# EAGLE design Elec 2013 Combined (EAGLE 6.4)
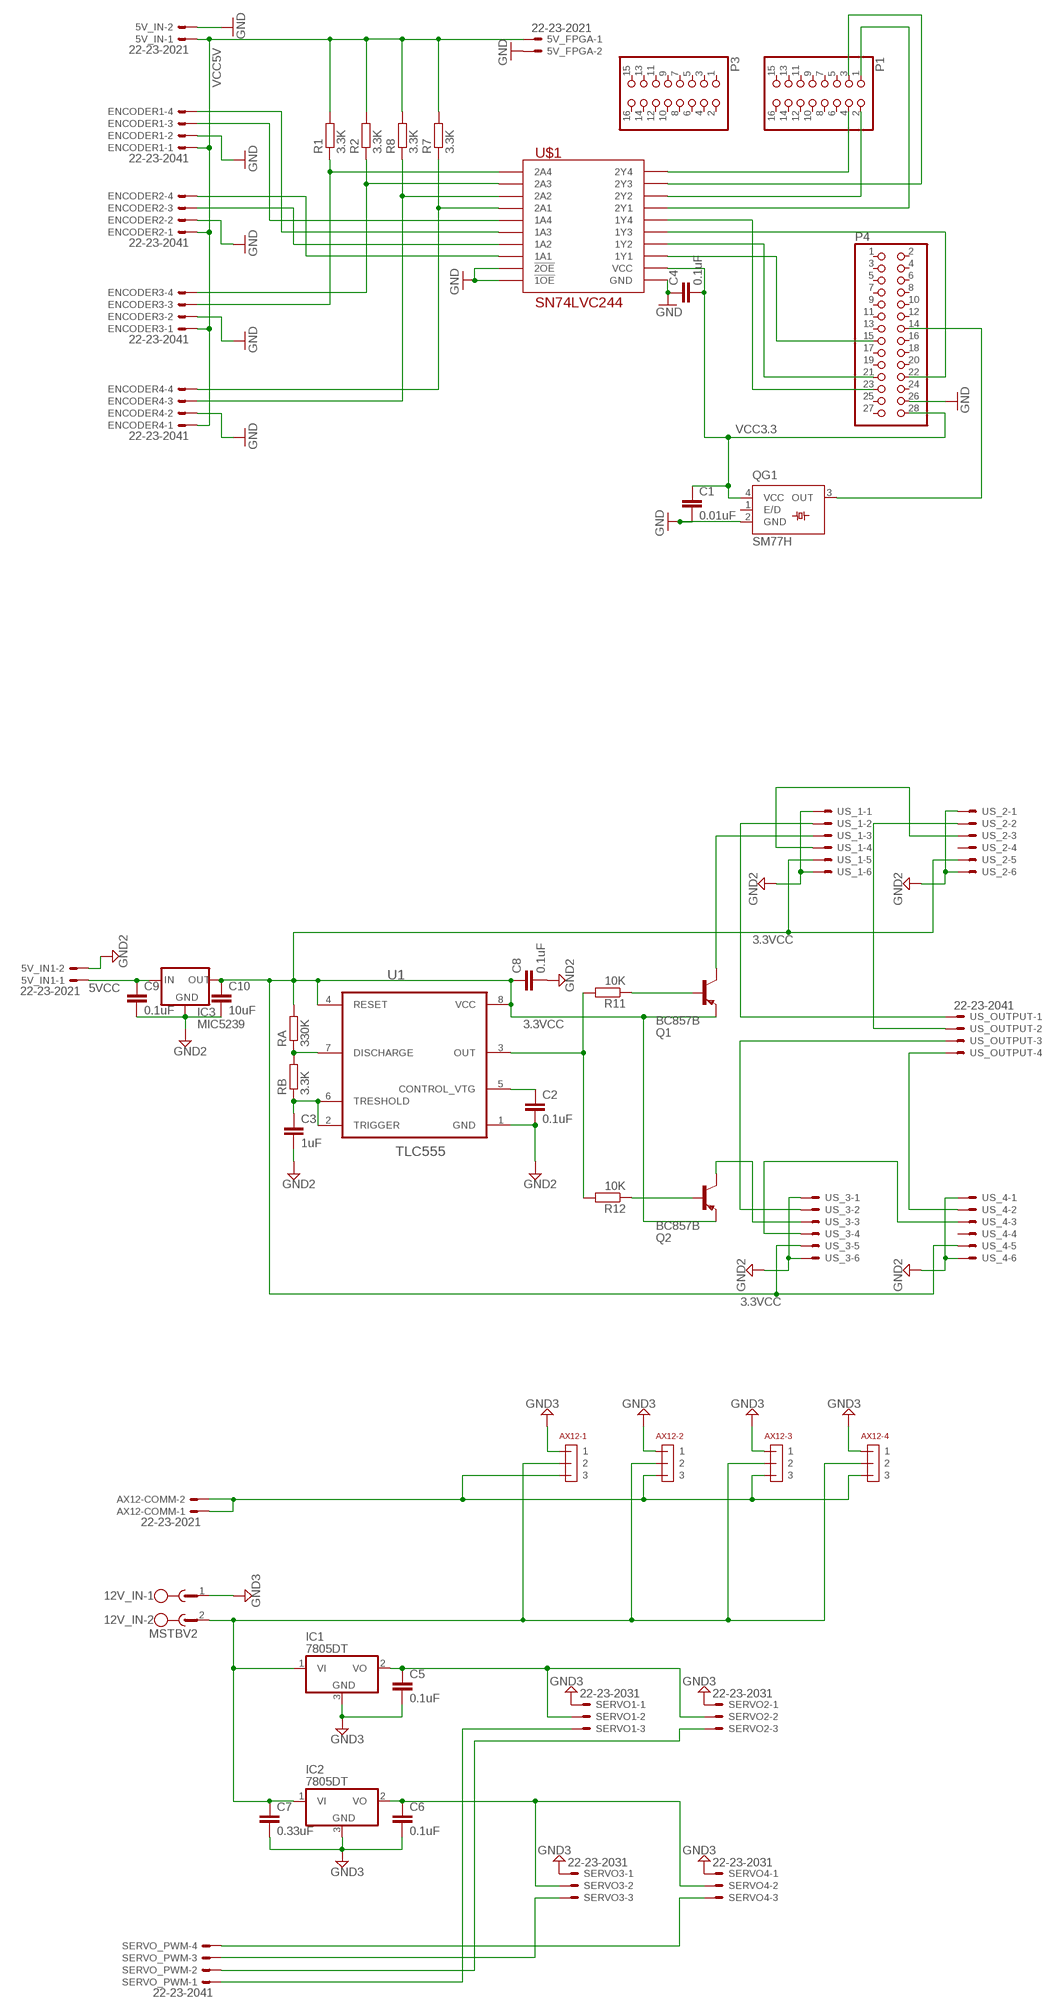
[diagram p0: schematic, sheet 1, part 1 of 2]
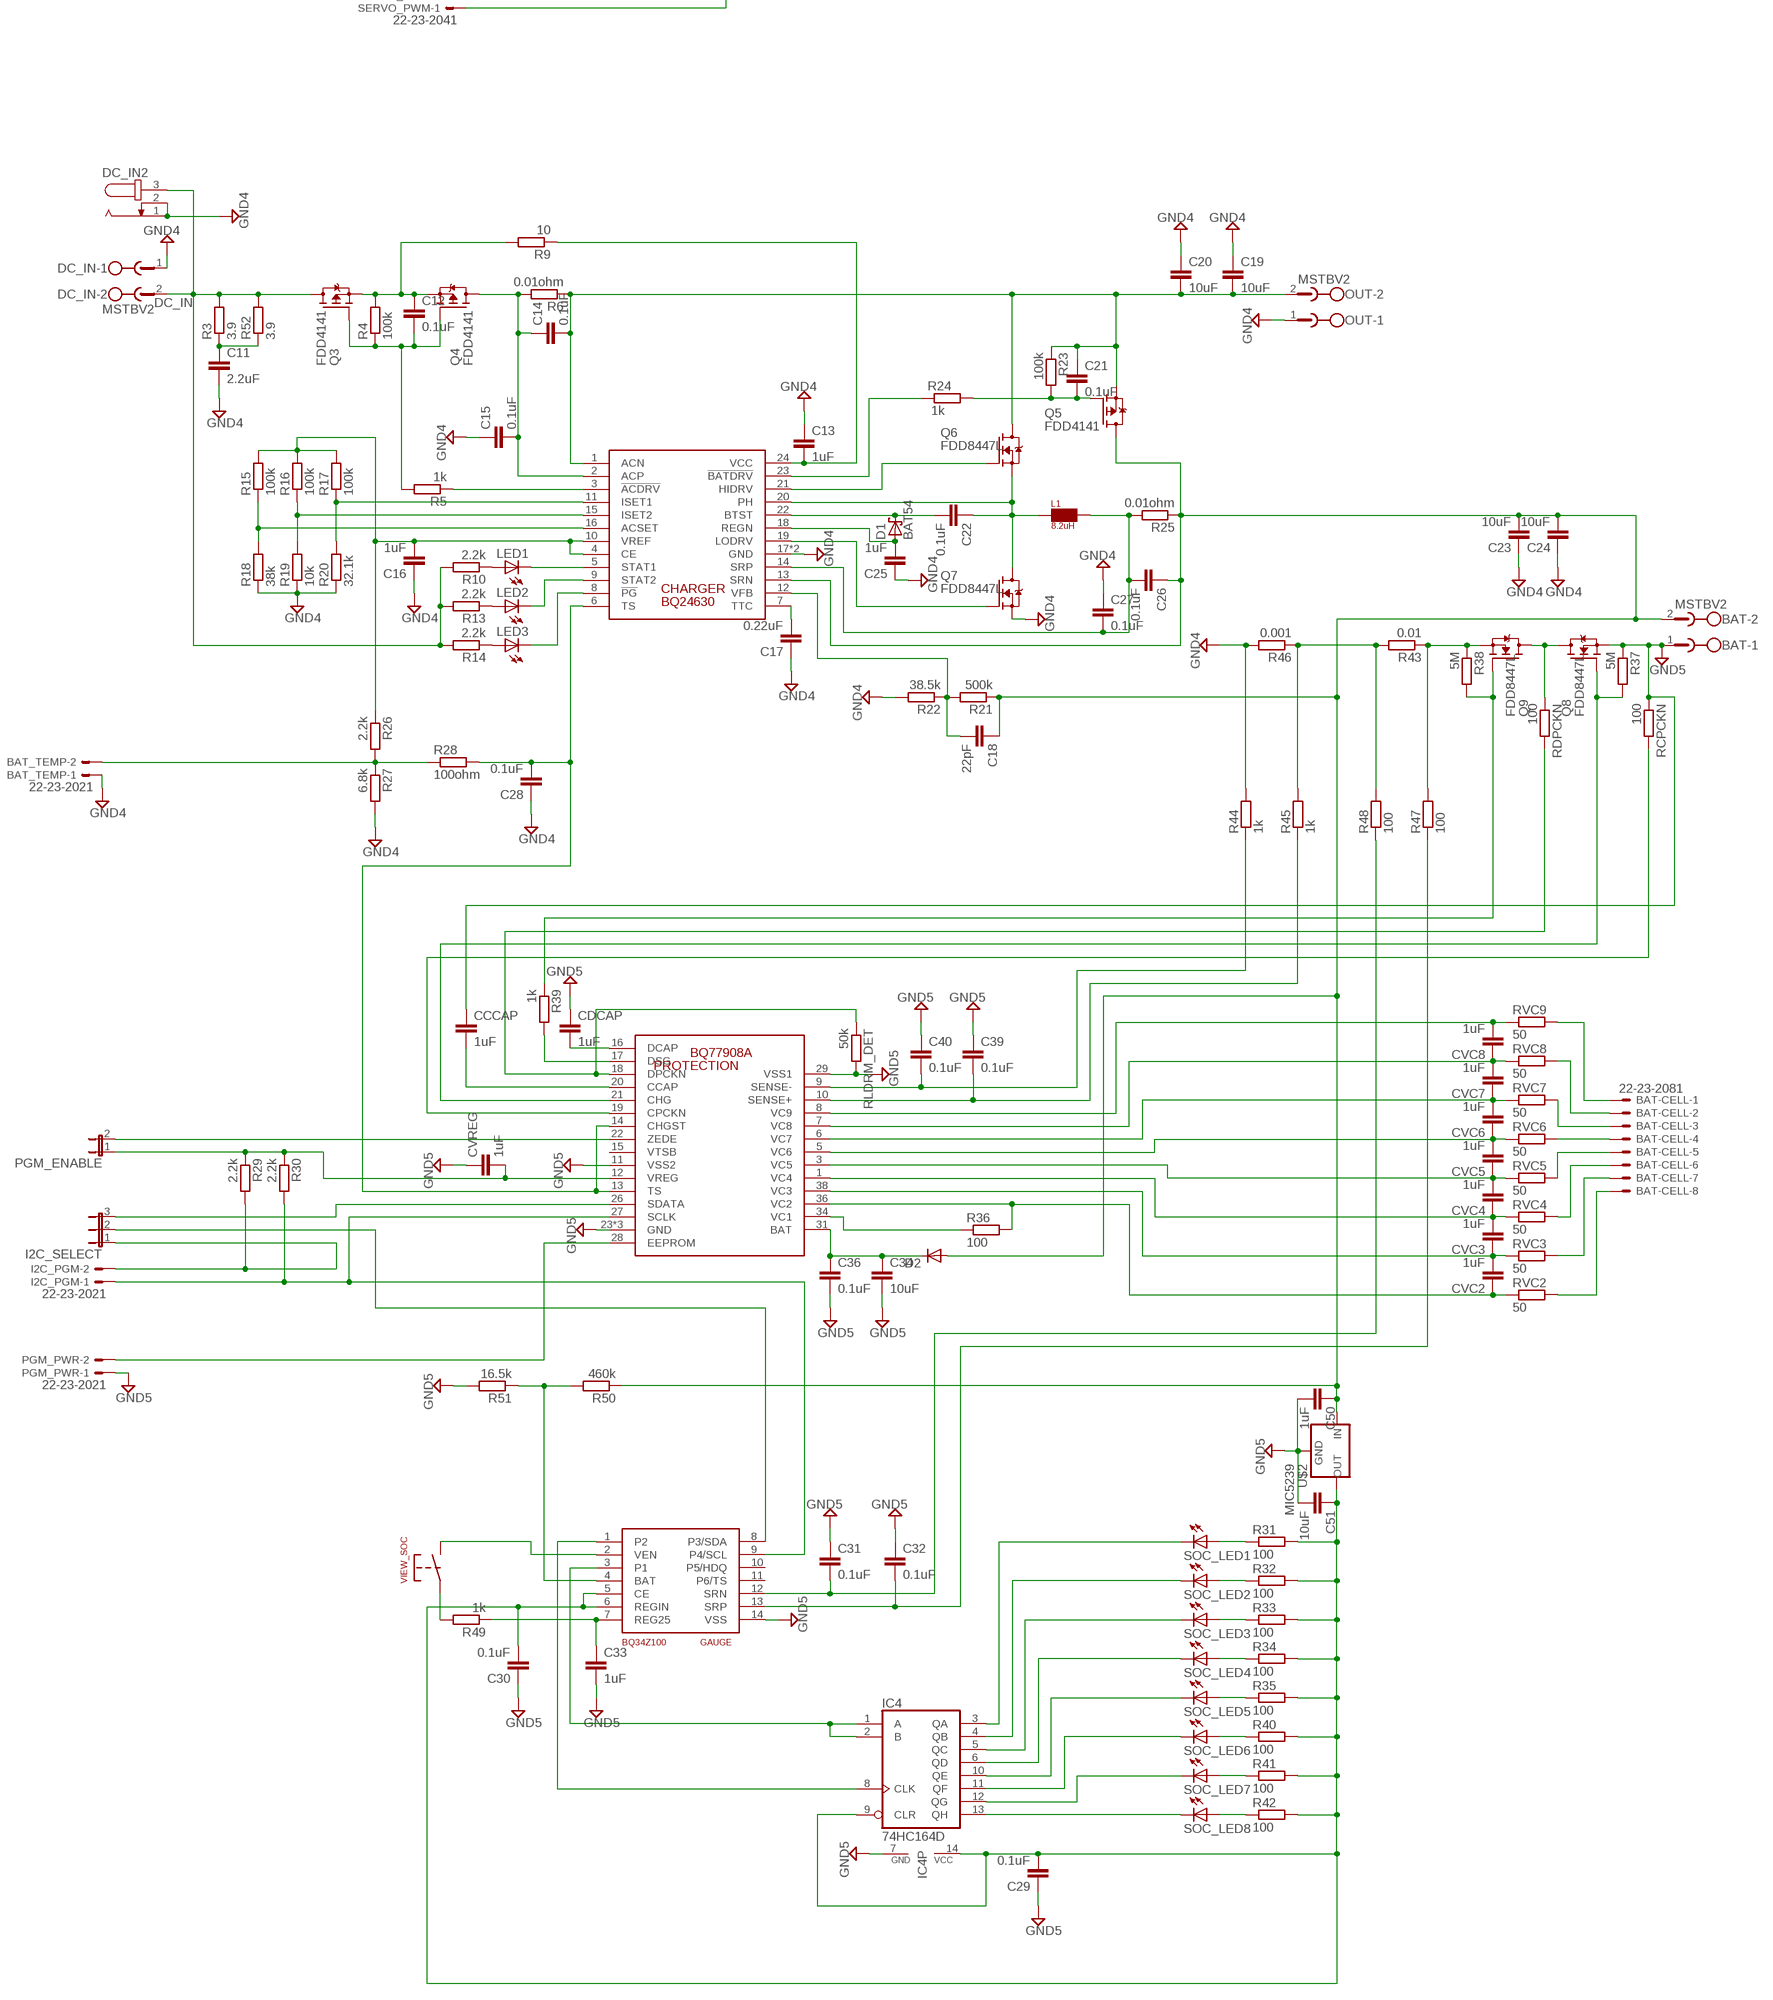
[diagram p1: schematic, sheet 1, part 2 of 2]

## Parts
5V_FPGA  22-23-2021  [22-23-2021]
5V_IN  22-23-2021  [22-23-2021]
5V_IN1  22-23-2021  [22-23-2021]
12V_IN  MSTBV2  [MSTBV2]
AX12-1  22-03-5035  [22-03-5035]
AX12-2  22-03-5035  [22-03-5035]
AX12-3  22-03-5035  [22-03-5035]
AX12-4  22-03-5035  [22-03-5035]
AX12-COMM  22-23-2021  [22-23-2021]
BAT  MSTBV2  [MSTBV2]
BAT-CELL  22-23-2081  [22-23-2081]
BAT_TEMP  22-23-2021  [22-23-2021]
C1  0.01uF  C-EUC0603  [C0603]
C2  0.1uF  C-EUC0603  [C0603]
C3  1uF  C-EUC0603  [C0603]
C4  0.1uF  C-EUC0603  [C0603]
C5  0.1uF  C-EUC0603  [C0603]
C6  0.1uF  C-EUC0603  [C0603]
C7  0.33uF  C-EUC0603  [C0603]
C8  0.1uF  C-EUC0603  [C0603]
C9  0.1uF  C-EUC0603  [C0603]
C10  10uF  C-EUC0603  [C0603]
C11  2.2uF  C-EUC1206  [C1206]
C12  0.1uF  C-EUC0603  [C0603]
C13  1uF  C-EUC1206  [C1206]
C14  0.1uF  C-EUC0603  [C0603]
C15  0.1uF  C-EUC0603  [C0603]
C16  1uF  C-EUC0805  [C0805]
C17  0.22uF  C-EUC0603  [C0603]
C18  22pF  C-EUC0603  [C0603]
C19  10uF  C-EUC1812  [C1812]
C20  10uF  C-EUC1812  [C1812]
C21  0.1uF  C-EUC0603  [C0603]
C22  0.1uF  C-EUC0603  [C0603]
C23  10uF  C-EUC1812  [C1812]
C24  10uF  C-EUC1812  [C1812]
C25  1uF  C-EUC0805  [C0805]
C26  0.1uF  C-EUC0603  [C0603]
C27  0.1uF  C-EUC0603  [C0603]
C28  0.1uF  C-EUC0603  [C0603]
C29  0.1uF  C-EUC0603  [C0603]
C30  0.1uF  C-EUC0603  [C0603]
C31  0.1uF  C-EUC0603  [C0603]
C32  0.1uF  C-EUC0603  [C0603]
C33  1uF  C-EUC0603  [C0603]
C34  10uF  C-EUC1210  [C1210]
C36  0.1uF  C-EUC1210  [C1210]
C39  0.1uF  C-EUC0603  [C0603]
C40  0.1uF  C-EUC0603  [C0603]
C50  1uF  C-EUC0603  [C0603]
C51  10uF  C-EUC0603  [C0603]
CCCAP  1uF  C-EUC1206  [C1206]
CDCAP  1uF  C-EUC1206  [C1206]
CHARGER  BQ24630  [QFN-24]
CVC2  1uF  C-EUC0603  [C0603]
CVC3  1uF  C-EUC0603  [C0603]
CVC4  1uF  C-EUC0603  [C0603]
CVC5  1uF  C-EUC0603  [C0603]
CVC6  1uF  C-EUC0603  [C0603]
CVC7  1uF  C-EUC0603  [C0603]
CVC8  1uF  C-EUC0603  [C0603]
CVREG  1uF  C-EUC0603  [C0603]
D1  BAT54  [SOT23]
D2  DIODE-SOD123  [SOD123]
DC_IN  MSTBV2  [MSTBV2]
DC_IN2  JACK-PLUG1  [SPC4078]
ENCODER1  22-23-2041  [22-23-2041]
ENCODER2  22-23-2041  [22-23-2041]
ENCODER3  22-23-2041  [22-23-2041]
ENCODER4  22-23-2041  [22-23-2041]
GAUGE  BQ34Z100  [TSSOP-14-0.65MM]
I2C_PGM  22-23-2021  [22-23-2021]
I2C_SELECT  JP2E  [JP2]
IC1  7805DT  [TO252]
IC2  7805DT  [TO252]
IC3  MIC5239  [SOT223]
IC4  74HC164D  [SO14]
L1  8.2uH  IHLP-5050CE  [5050CE]
LED1  LEDCHIP-LED0603  [CHIP-LED0603]
LED2  LEDCHIP-LED0603  [CHIP-LED0603]
LED3  LEDCHIP-LED0603  [CHIP-LED0603]
OUT  MSTBV2  [MSTBV2]
P1  PINHD-2X8  [2X08]
P3  PINHD-2X8  [2X08]
P4  PINHD-2X14  [2X14]
PGM_ENABLE  JP1E  [JP1]
PGM_PWR  22-23-2021  [22-23-2021]
PROTECTION  BQ77908A  [TSSOP-38-0.5MM]
Q1  BC857B  MMBTA56-SOT23  [SOT23]
Q2  BC857B  MMBTA56-SOT23  [SOT23]
Q3  FDD4141  FDD4141TO252  [TO252]
Q4  FDD4141  FDD4141TO252  [TO252]
Q5  FDD4141  FDD4141TO252  [TO252]
Q6  FDD8447L  [TO252]
Q7  FDD8447L  [TO252]
Q8  FDD8447L  [TO252]
Q9  FDD8447L  [TO252]
QG1  SM77H  [SM77H]
R1  3.3K  R-EU_R0603  [R0603]
R2  3.3K  R-EU_R0603  [R0603]
R3  3.9  R-EU_R1206  [R1206]
R4  100k  R-EU_R0603  [R0603]
R5  1k  R-EU_R0603  [R0603]
R6  0.01ohm  R-EU_R2010  [R2010]
R7  3.3K  R-EU_R0603  [R0603]
R8  3.3K  R-EU_R0603  [R0603]
R9  10  R-EU_R1206  [R1206]
R10  2.2k  R-EU_R0603  [R0603]
R11  10K  R-EU_R0603  [R0603]
R12  10K  R-EU_R0603  [R0603]
R13  2.2k  R-EU_R0603  [R0603]
R14  2.2k  R-EU_R0603  [R0603]
R15  100k  R-EU_R0805  [R0805]
R16  100k  R-EU_R0805  [R0805]
R17  100k  R-EU_R0805  [R0805]
R18  38k  R-EU_R0805  [R0805]
R19  10k  R-EU_R0805  [R0805]
R20  32.1k  R-EU_R0805  [R0805]
R21  500k  R-EU_R0805  [R0805]
R22  38.5k  R-EU_R0805  [R0805]
R23  100k  R-EU_R0603  [R0603]
R24  1k  R-EU_R0603  [R0603]
R25  0.01ohm  R-EU_R2010  [R2010]
R26  2.2k  R-EU_R0603  [R0603]
R27  6.8k  R-EU_R0603  [R0603]
R28  100ohm  R-EU_R0603  [R0603]
R29  2.2k  R-EU_R0603  [R0603]
R30  2.2k  R-EU_R0603  [R0603]
R31  100  R-EU_R0603  [R0603]
R32  100  R-EU_R0603  [R0603]
R33  100  R-EU_R0603  [R0603]
R34  100  R-EU_R0603  [R0603]
R35  100  R-EU_R0603  [R0603]
R36  100  R-EU_R0603  [R0603]
R37  5M  R-EU_R0603  [R0603]
R38  5M  R-EU_R0603  [R0603]
R39  1k  R-EU_R0603  [R0603]
R40  100  R-EU_R0603  [R0603]
R41  100  R-EU_R0603  [R0603]
R42  100  R-EU_R0603  [R0603]
R43  0.01  R-EU_R2010  [R2010]
R44  1k  R-EU_R0603  [R0603]
R45  1k  R-EU_R0603  [R0603]
R46  0.001  R-EU_R2010  [R2010]
R47  100  R-EU_R0603  [R0603]
R48  100  R-EU_R0603  [R0603]
R49  1k  R-EU_R0603  [R0603]
R50  460k  R-EU_R0805  [R0805]
R51  16.5k  R-EU_R0603  [R0603]
R52  3.9  R-EU_R1206  [R1206]
RA  330K  R-EU_R0603  [R0603]
RB  3.3K  R-EU_R0603  [R0603]
RCPCKN  100  R-EU_R0603  [R0603]
RDPCKN  100  R-EU_R0603  [R0603]
RLDRM_DET  50k  R-EU_R0603  [R0603]
RVC2  50  R-EU_R1206  [R1206]
RVC3  50  R-EU_R1206  [R1206]
RVC4  50  R-EU_R1206  [R1206]
RVC5  50  R-EU_R1206  [R1206]
RVC6  50  R-EU_R1206  [R1206]
RVC7  50  R-EU_R1206  [R1206]
RVC8  50  R-EU_R1206  [R1206]
RVC9  50  R-EU_R1206  [R1206]
SERVO1  22-23-2031  [22-23-2031]
SERVO2  22-23-2031  [22-23-2031]
SERVO3  22-23-2031  [22-23-2031]
SERVO4  22-23-2031  [22-23-2031]
SERVO_PWM  22-23-2041  [22-23-2041]
SOC_LED1  LEDCHIP-LED0603  [CHIP-LED0603]
SOC_LED2  LEDCHIP-LED0603  [CHIP-LED0603]
SOC_LED3  LEDCHIP-LED0603  [CHIP-LED0603]
SOC_LED4  LEDCHIP-LED0603  [CHIP-LED0603]
SOC_LED5  LEDCHIP-LED0603  [CHIP-LED0603]
SOC_LED6  LEDCHIP-LED0603  [CHIP-LED0603]
SOC_LED7  LEDCHIP-LED0603  [CHIP-LED0603]
SOC_LED8  LEDCHIP-LED0603  [CHIP-LED0603]
U1  TLC555  LM555CM  [SOIC127P600X175-8N]
U$1  SN74LVC244  [TSSOP-20-0.65MM]
U$2  MIC5239  [SOT223]
US_1  22-23-2061  [22-23-2061]
US_2  22-23-2061  [22-23-2061]
US_3  22-23-2061  [22-23-2061]
US_4  22-23-2061  [22-23-2061]
US_OUTPUT  22-23-2041  [22-23-2041]
VIEW_SOC  PUSHBUTTON  [PUSHBUTTON]

## Nets
3.3VCC: C8.1 C10.1 IC3.3(OUT) Q1.2(E) Q2.2(E) RA.2 U1.4(RESET) U1.8(VCC) US_1.5 US_2.5 US_3.5 US_4.5
5VCC: 5V_IN1.1 C9.1 IC3.1(IN)
DC_IN: DC_IN2.3 DC_IN.2 Q3.3(D) R3.2 R10.2 R13.2 R14.2 R52.2
GND: 5V_FPGA.2 5V_IN.2 C1.2 C4.1 ENCODER1.2 ENCODER2.2 ENCODER3.2 ENCODER4.2 P4.26 QG1.2(GND) U$1.P$1(!1OE) U$1.P$10(GND) U$1.P$19(!2OE)
GND2: 5V_IN1.2 C2.2 C3.2 C8.2 C9.2 C10.2 IC3.2(GND) IC3.4(GND) U1.1(GND) US_1.1 US_1.6 US_2.1 US_2.6 US_3.1 US_3.6 US_4.1 US_4.6
GND3: 12V_IN.1 AX12-1.P$1 AX12-2.P$1 AX12-3.P$1 AX12-4.P$1 C5.2 C6.2 C7.2 IC1.3(GND) IC2.3(GND) SERVO1.1 SERVO2.1 SERVO3.1 SERVO4.1
GND4: BAT_TEMP.1 C11.2 C13.1 C15.1 C16.1 C17.1 C19.1 C20.1 C23.1 C24.1 C25.1 C27.1 C28.1 CHARGER.17(GND) CHARGER.THERMAL(GND) DC_IN2.1 DC_IN2.2 DC_IN.1 OUT.1 Q7.2(S) R18.1 R19.1 R20.1 R22.2 R27.2 R44.2 R46.2
GND5: BAT.1 C29.1 C30.1 C31.1 C32.1 C33.2 C34.2 C36.2 C39.1 C40.1 C50.2 C51.2 CCCAP.1 CDCAP.1 CVREG.1 GAUGE.14(VSS) IC4.7(GND) PGM_PWR.1 PROTECTION.11(VSS2) PROTECTION.23(GND) PROTECTION.24(GND) PROTECTION.25(GND) PROTECTION.29(VSS1) Q8.2(S) R37.1 R51.2 RCPCKN.1 RLDRM_DET.2 U$2.2(GND) U$2.4(GND)
N$1: P4.14 QG1.3(OUT)
N$2: P4.23 U$1.P$12(1Y4)
N$3: P4.21 U$1.P$16(1Y2)
N$4: P4.15 U$1.P$18(1Y1)
N$5: P4.22 U$1.P$14(1Y3)
N$6: P1.4 U$1.P$3(2Y4)
N$7: P1.2 U$1.P$7(2Y2)
N$8: P1.1 U$1.P$9(2Y1)
N$9: P1.3 U$1.P$5(2Y3)
N$10: ENCODER3.3 R1.1 U$1.P$17(2A4)
N$11: ENCODER3.4 R2.1 U$1.P$15(2A3)
N$12: R11.2 R12.2 U1.3(OUT)
N$13: C11.1 R3.1 R52.1
N$14: ENCODER4.3 R8.1 U$1.P$13(2A2)
N$15: ENCODER4.4 R7.1 U$1.P$11(2A1)
N$16: ENCODER1.3 U$1.P$8(1A4)
N$17: ENCODER1.4 U$1.P$6(1A3)
N$18: ENCODER2.3 U$1.P$4(1A2)
N$19: ENCODER2.4 U$1.P$2(1A1)
N$20: C3.1 RB.1 U1.2(TRIGGER) U1.6(TRESHOLD)
N$21: C2.1 U1.5(CONTROL_VTG)
N$22: RA.1 RB.2 U1.7(DISCHARGE)
N$23: Q2.1(B) R12.1
N$24: Q1.1(B) R11.1
N$25: US_1.2 US_OUTPUT.1
N$26: US_2.2 US_OUTPUT.2
N$27: US_3.2 US_OUTPUT.3
N$28: US_4.2 US_OUTPUT.4
N$29: US_1.4 US_2.3
N$30: US_3.4 US_4.3
N$31: Q1.3(C) US_1.3
N$32: Q2.3(C) US_3.3
N$33: SERVO1.3 SERVO_PWM.1
N$34: SERVO2.3 SERVO_PWM.2
N$35: SERVO3.3 SERVO_PWM.3
N$36: C6.1 IC2.2(VO) SERVO3.2 SERVO4.2
N$37: SERVO4.3 SERVO_PWM.4
N$38: 12V_IN.2 AX12-1.P$2 AX12-2.P$2 AX12-3.P$2 AX12-4.P$2 C7.1 IC1.1(VI) IC2.1(VI)
N$39: C5.1 IC1.2(VO) SERVO1.2 SERVO2.2
N$40: AX12-1.P$3 AX12-2.P$3 AX12-3.P$3 AX12-4.P$3 AX12-COMM.1 AX12-COMM.2
N$41: C12.1 Q3.2(S) Q4.2(S) R4.2 R9.2
N$42: C12.2 Q3.1(G) Q4.1(G) R4.1 R5.2
N$43: CHARGER.3(!ACDRV!) R5.1
N$44: C17.2 CHARGER.7(TTC)
N$45: C13.2 CHARGER.24(VCC) R9.1
N$46: C14.2 C19.2 C20.2 C21.1 CHARGER.1(ACN) OUT.2 Q5.2(S) Q6.3(D) R6.1 R23.1
N$47: C18.2 CHARGER.12(VFB) R21.2 R22.1
N$48: CHARGER.5(STAT1) LED1.C
N$49: CHARGER.9(STAT2) LED2.C
N$50: CHARGER.8(!PG!) LED3.C
N$51: LED1.A R10.1
N$52: LED2.A R13.1
N$53: LED3.A R14.1
N$54: BAT_TEMP.2 R26.2 R27.1 R28.1
N$55: CHARGER.16(ACSET) R15.1 R18.2
N$56: CHARGER.15(ISET2) R16.1 R19.2
N$57: CHARGER.11(ISET1) R17.1 R20.2
N$58: Q8.3(D) Q9.3(D) RDPCKN.1
N$59: C28.2 CHARGER.6(TS) PROTECTION.13(TS) PROTECTION.14(CHGST) R28.2
N$60: C21.2 Q5.1(G) R23.2 R24.2
N$61: C32.2 GAUGE.13(SRP) R47.1
N$62: CHARGER.23(!BATDRV!) R24.1
N$63: CHARGER.21(HIDRV) Q6.1(G)
N$64: C22.1 CHARGER.20(PH) L1.P$1 Q6.2(S) Q7.3(D)
N$65: C22.2 CHARGER.22(BTST) D1.3(C)
N$66: C34.1 C36.1 D2.C PROTECTION.31(BAT)
N$67: C26.2 C27.2 CHARGER.14(SRP) L1.P$2 R25.2
N$68: BAT-CELL.8 RVC2.2
N$69: C25.2 CHARGER.18(REGN) D1.1(A)
N$70: CHARGER.19(LODRV) Q7.1(G)
N$71: CVC8.2 PROTECTION.8(VC9) RVC9.1
N$72: CVC2.1 PROTECTION.36(VC2) R36.2 RVC2.1
N$73: CVC4.2 CVC5.1 PROTECTION.3(VC5) RVC5.1
N$74: CVC2.2 CVC3.1 PROTECTION.38(VC3) RVC3.1
N$75: PROTECTION.34(VC1) R36.1
N$76: CVC6.2 CVC7.1 PROTECTION.6(VC7) RVC7.1
N$77: CVC5.2 CVC6.1 PROTECTION.5(VC6) RVC6.1
N$78: CVC3.2 CVC4.1 PROTECTION.1(VC4) RVC4.1
N$79: BAT-CELL.7 RVC3.2
N$80: BAT-CELL.6 RVC4.2
N$81: BAT-CELL.5 RVC5.2
N$82: BAT-CELL.4 RVC6.2
N$83: BAT-CELL.3 RVC7.2
N$84: BAT-CELL.2 RVC8.2
N$85: BAT-CELL.1 RVC9.2
N$86: C33.1 GAUGE.7(REG25) R49.1
N$87: Q9.1(G) R38.2 R39.1
N$88: PROTECTION.21(CHG) Q8.1(G) R37.2
N$89: PROTECTION.17(DSG) R39.2
N$90: CDCAP.2 PROTECTION.16(DCAP)
N$91: CVC7.2 CVC8.1 PROTECTION.7(VC8) RVC8.1
N$92: PROTECTION.18(DPCKN) RDPCKN.2 RLDRM_DET.1
N$93: R31.1 SOC_LED1.A
N$94: PROTECTION.19(CPCKN) RCPCKN.2
N$95: CCCAP.2 PROTECTION.20(CCAP)
N$96: R32.1 SOC_LED2.A
N$97: C39.2 PROTECTION.10(SENSE+) R45.1
N$99: C40.2 PROTECTION.9(SENSE-) R44.1
N$100: GAUGE.9(P4/SCL) I2C_PGM.1 PROTECTION.27(SCLK) R30.2
N$101: I2C_PGM.2 I2C_SELECT.1 R29.2
N$102: R33.1 SOC_LED3.A
N$103: PGM_ENABLE.2 PROTECTION.22(ZEDE)
N$104: PGM_PWR.2 PROTECTION.28(EEPROM)
N$105: C29.2 C30.2 C51.1 GAUGE.5(CE) GAUGE.6(REGIN) IC4.9(CLR) IC4.14(VCC) R31.2 R32.2 R33.2 R34.2 R35.2 R40.2 R41.2 R42.2 U$2.3(OUT)
N$106: R34.1 SOC_LED4.A
N$107: R35.1 SOC_LED5.A
N$108: R40.1 SOC_LED6.A
N$109: R41.1 SOC_LED7.A
N$110: R42.1 SOC_LED8.A
N$111: IC4.13(QH) SOC_LED8.C
N$112: IC4.3(QA) SOC_LED1.C
N$113: IC4.4(QB) SOC_LED2.C
N$114: IC4.5(QC) SOC_LED3.C
N$115: IC4.6(QD) SOC_LED4.C
N$116: IC4.10(QE) SOC_LED5.C
N$118: IC4.12(QG) SOC_LED7.C
N$120: I2C_SELECT.3 PROTECTION.26(SDATA)
N$121: GAUGE.8(P3/SDA) I2C_SELECT.2
N$122: C31.2 GAUGE.12(SRN) R48.1
N$123: GAUGE.3(P1) IC4.1(A) IC4.2(B)
N$124: GAUGE.1(P2) IC4.8(CLK)
N$126: R49.2 VIEW_SOC.P$1 VIEW_SOC.P$2
N$127: GAUGE.2(VEN) VIEW_SOC.P$3 VIEW_SOC.P$4
N$128: GAUGE.4(BAT) R50.2 R51.1
N$129: BAT.2 C18.1 C23.2 C24.2 C26.1 C50.1 CHARGER.13(SRN) D2.A Q5.3(D) R21.1 R25.1 R50.1 U$2.1(IN)
N$130: CVREG.2 PGM_ENABLE.1 PROTECTION.12(VREG) R29.1 R30.1
N$131: R43.2 R45.2 R46.1 R48.2
N$132: Q9.2(S) R38.1 R43.1 R47.2
SI7617DN: C14.1 C15.2 CHARGER.2(ACP) Q4.3(D) R6.2
SOC_LED6: IC4.11(QF) SOC_LED6.C
VCC3.3: C1.1 C4.2 P4.28 QG1.4(VCC) U$1.P$20(VCC)
VCC5V: 5V_FPGA.1 5V_IN.1 ENCODER1.1 ENCODER2.1 ENCODER3.1 ENCODER4.1 R1.2 R2.2 R7.2 R8.2
VREF: C16.2 CHARGER.4(CE) CHARGER.10(VREF) R15.2 R16.2 R17.2 R26.1
Unconnected: GAUGE.10(P5/HDQ) GAUGE.11(P6/TS) P1.5 P1.6 P1.7 P1.8 P1.9 P1.10 P1.11 P1.12 P1.13 P1.14 P1.15 P1.16 P3.1 P3.2 P3.3 P3.4 P3.5 P3.6 P3.7 P3.8 P3.9 P3.10 P3.11 P3.12 P3.13 P3.14 P3.15 P3.16 P4.1 P4.2 P4.3 P4.4 P4.5 P4.6 P4.7 P4.8 P4.9 P4.10 P4.11 P4.12 P4.13 P4.16 P4.17 P4.18 P4.19 P4.20 P4.24 P4.25 P4.27 PROTECTION.15(VTSB) QG1.1(E/D) US_2.4 US_4.4

## Library data of the parts
5V_FPGA 5V_IN 5V_IN1 AX12-COMM BAT_TEMP I2C_PGM PGM_PWR = con-molex:22-23-2021: .100" (2.54mm) Center Header - 2 Pin; MF: MOLEX; MPN: 22-23-2021; OC_FARNELL: 1462926; OC_NEWARK: 25C3832
12V_IN BAT DC_IN OUT = con-phoenix-508:MSTBV2: PHOENIX; MPN: MSTBV 2,5/2-GF-5.08; OC_FARNELL: 1792792; OC_NEWARK: 69R9845
AX12-1-AX12-4 = custom:22-03-5035
BAT-CELL = con-molex:22-23-2081: .100" (2.54mm) Center Header - 8 Pin; MF: MOLEX; MPN: 22-23-2081; OC_FARNELL: 1756826; OC_NEWARK: 01C7592
C1-C34 C36 C39 C40 C50 C51 CCCAP CDCAP CVC2-CVC8 CVREG = rcl:C-EU: CAPACITOR, European symbol
CHARGER = custom:BQ24630
D1 = diode:BAT54: Schottky Diodes Source: Fairchild .. BAT54.pdf
D2 = diode:DIODE-: DIODE
DC_IN2 = con-jack:JACK-PLUG: DC POWER JACK Power Jack, DC, Right Angle, Through Hole, Rated 5A at 16VDC, PC Terminals Distributor: Farnell (www.Farnell.de) Drawing: 84N1161.pdf / 84N1162.pdf Manufacturer: SPC Technology (www.spctechnology.com) Type: SPC4077 / SPC 4078; OC_FARNELL: unknown; OC_NEWARK: unknown
ENCODER1-ENCODER4 SERVO_PWM US_OUTPUT = con-molex:22-23-2041: .100" (2.54mm) Center Header - 4 Pin; MF: MOLEX; MPN: 22-23-2041; OC_FARNELL: 1462920; OC_NEWARK: 38C0355
GAUGE = custom:BQ34Z100
I2C_SELECT = jumper:JP2E: JUMPER
IC1 IC2 = linear:78*: Positive VOLTAGE REGULATOR Source: http://cache.national.com/ds/LM/LM78L05.pdf http://www.fairchildsemi.com/ds/LM/LM7805.pdf
IC3 U$2 = v-reg:MIC5239
IC4 = 74xx-eu:74*164: 8-bit parallel out SHIFT REGISTER
L1 = custom:IHLP-5050CE
LED1-LED3 SOC_LED1-SOC_LED8 = led:LED: LED OSRAM: - CHIPLED LG R971, LG N971, LY N971, LG Q971, LY Q971, LO R971, LY R971 LH N974, LH R974 LS Q976, LO Q976, LY Q976 LO Q996 - Hyper CHIPLED LW Q18S LB Q993, LB Q99A, LB R99A - SideLED LS A670, LO A670, LY A670, LG A670, LP A670 LB A673, LV A673, LT A673, LW A673 LH A674 LY A675 LS A676, LA A676, LO A676, LY A676, LW A676 LS A679, LY A679, LG A679 - Hyper Micro SIDELED® LS Y876, LA Y876, LO Y876, LY Y876 LT Y87S - SmartLED LW L88C, LW L88S LB L89C, LB L89S, LG L890 LS L89K, LO L89K, LY L89K LS L896, LA L896, LO L896, LY L896 - TOPLED LS T670, LO T670, LY T670, LG T670, LP T670 LSG T670, LSP T670, LSY T670, LOP T670, LYG T670 LG T671, LOG T671, LSG T671 LB T673, LV T673, LT T673, LW T673 LH T674 LS T676, LA T676, LO T676, LY T676, LB T676, LH T676, LSB T676, LW T676 LB T67C, LV T67C, LT T67C, LS T67K, LO T67K, LY T67K, LW E67C LS E67B, LA E67B, LO E67B, LY E67B, LB E67C, LV E67C, LT E67C LW T67C LS T679, LY T679, LG T679 LS T770, LO T770, LY T770, LG T770, LP T770 LB T773, LV T773, LT T773, LW T773 LH T774 LS E675, LA E675, LY E675, LS T675 LS T776, LA T776, LO T776, LY T776, LB T776 LHGB T686 LT T68C, LB T68C - Hyper Mini TOPLED® LB M676 - Mini TOPLED Santana® LG M470 LS M47K, LO M47K, LY M47K Source: http://www.osram.convergy.de LUXEON: - LUMILED® LXK2-PW12-R00, LXK2-PW12-S00, LXK2-PW14-U00, LXK2-PW14-V00 LXK2-PM12-R00, LXK2-PM12-S00, LXK2-PM14-U00 LXK2-PE12-Q00, LXK2-PE12-R00, LXK2-PE12-S00, LXK2-PE14-T00, LXK2-PE14-U00 LXK2-PB12-K00, LXK2-PB12-L00, LXK2-PB12-M00, LXK2-PB14-N00, LXK2-PB14-P00, LXK2-PB14-Q00 LXK2-PR12-L00, LXK2-PR12-M00, LXK2-PR14-Q00, LXK2-PR14-R00 LXK2-PD12-Q00, LXK2-PD12-R00, LXK2-PD12-S00 LXK2-PH12-R00, LXK2-PH12-S00 LXK2-PL12-P00, LXK2-PL12-Q00, LXK2-PL12-R00 Source: www.luxeon.com KINGBRIGHT: KA-3528ASYC Source: www.kingbright.com
P1 P3 = pinhead:PINHD-2X8: PIN HEADER
P4 = pinhead:PINHD-2X14: PIN HEADER
PGM_ENABLE = jumper:JP1E: JUMPER
PROTECTION = custom:BQ77908A
Q1 Q2 = transistor-pnp:*-?: PNP Transistor
Q3-Q5 = transistor-fet:FDD4141: P-Channel PowerTrench® MOSFET Source: FDD4141.pdf
Q6-Q9 = transistor-fet:FDD8447L
QG1 = crystal:SM77H: 3.3V CMOS Clock Oscillator Source: www.pletronics.com .. sm77h%203.3v.pdf; OC_FARNELL: unknown; OC_NEWARK: unknown
R1-R52 RA RB RCPCKN RDPCKN RLDRM_DET RVC2-RVC9 = rcl:R-EU_: RESISTOR, European symbol
SERVO1-SERVO4 = con-molex:22-23-2031: .100" (2.54mm) Center Header - 3 Pin; MF: MOLEX; MPN: 22-23-2031; OC_FARNELL: 1462950; OC_NEWARK: 30C0862
U1 = custom:LM555CM: Single Timer; MPN: LM555CM; OC_FARNELL: 9488227; OC_NEWARK: 78K6011; PACKAGE: SOIC-8; SUPPLIER: LM555CM
U$1 = custom:SN74LVC244
US_1-US_4 = con-molex:22-23-2061: .100" (2.54mm) Center Header - 6 Pin; MF: MOLEX; MPN: 22-23-2061; OC_FARNELL: 1462922; OC_NEWARK: 27C1933
VIEW_SOC = custom:PUSHBUTTON

## Board
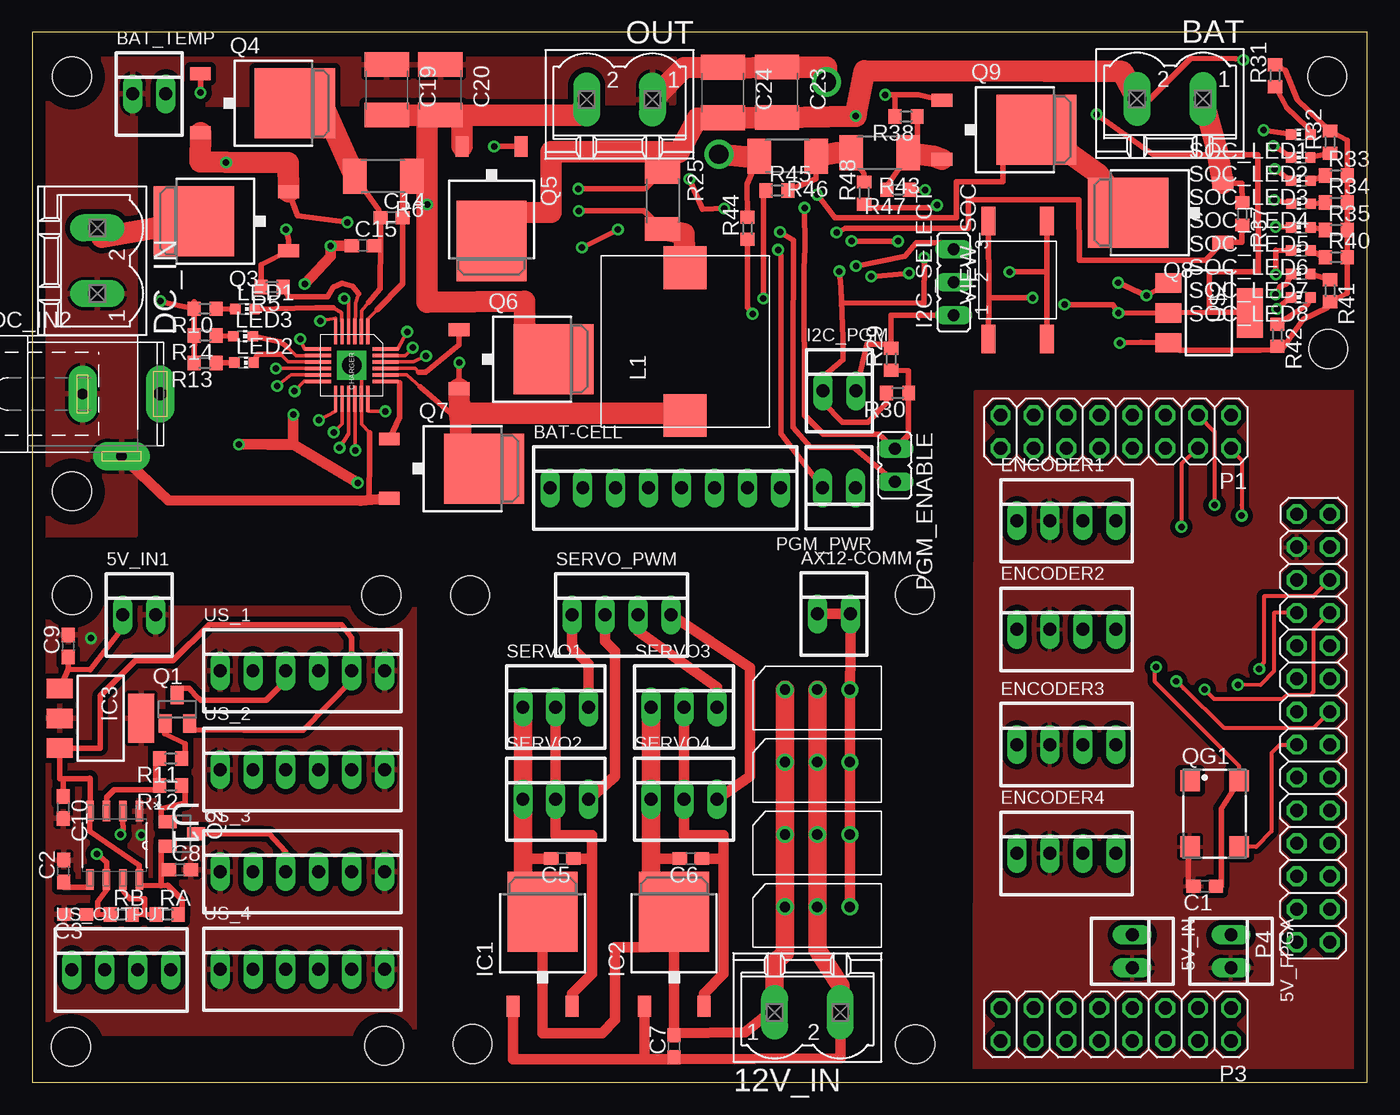
[diagram p2: board, top side]
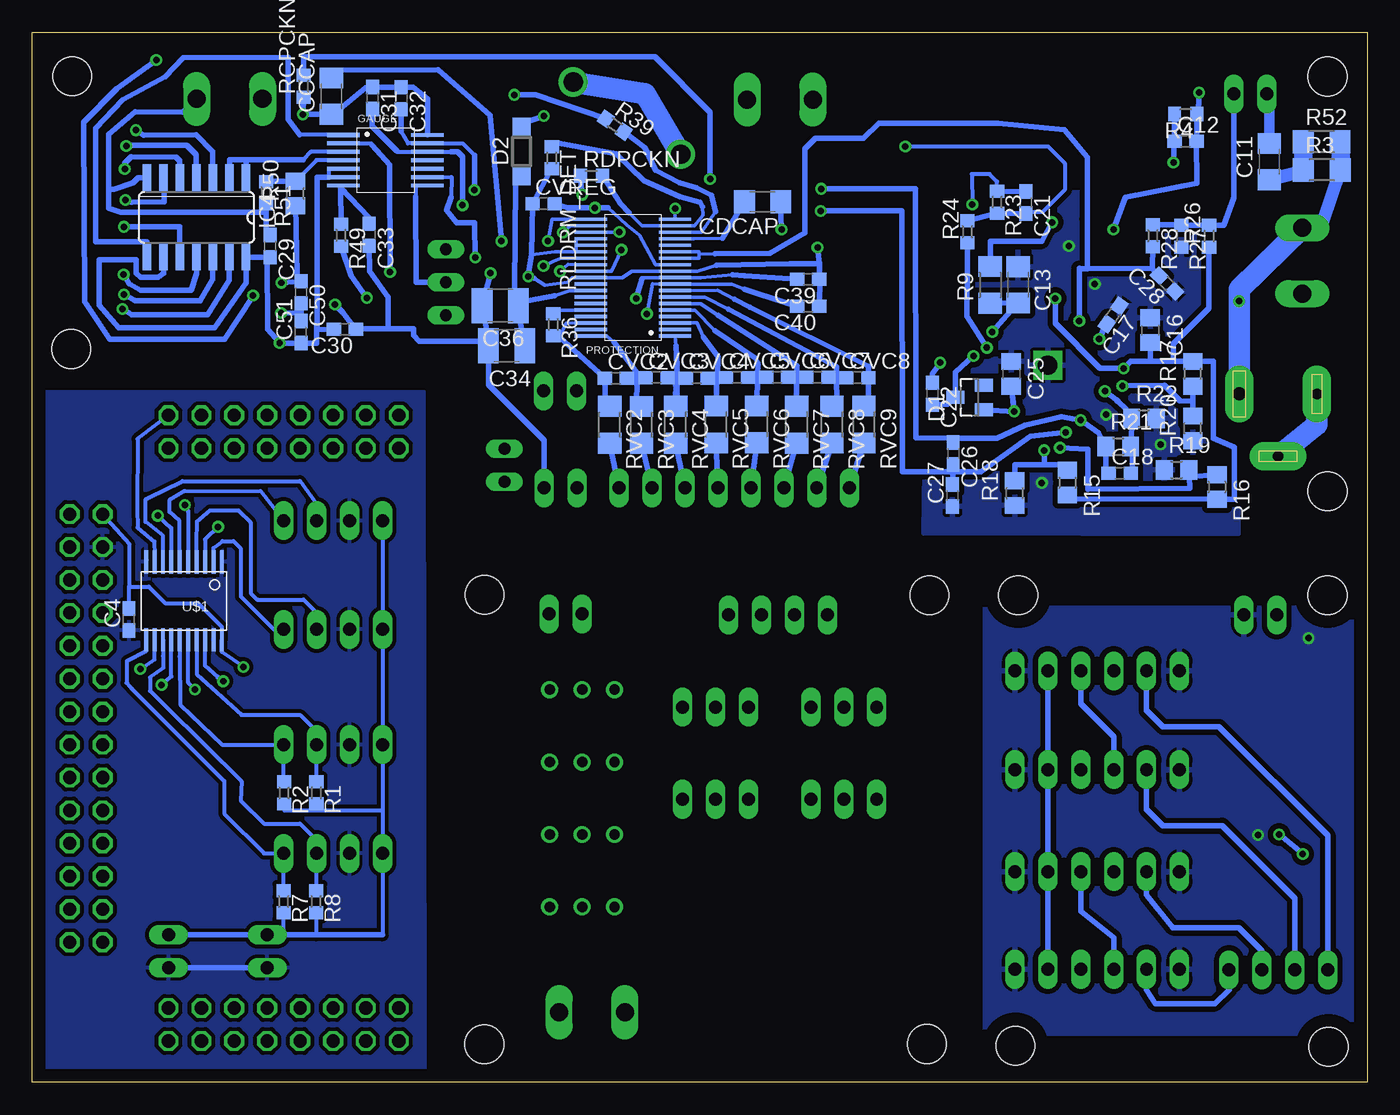
[diagram p3: board, bottom side, seen from below]

Size 103 x 81 mm. Coordinates in mm from the lower left corner, seen from the top.
Outline: 0,0 103,0 103,81 0,81 0,0
Copper layers (1*16): Top 0.035mm / dielectric 1.5mm / Bottom 0.035mm
Design rules "default *": minimum track width 8mil, minimum drill 0.3mm, track to track 8mil, track to pad 8mil, pad to pad 8mil, via to via 8mil, smd to smd 8mil, copper to edge 40mil, drill to drill 8mil, minimum pad ring 10mil, minimum via ring 8mil, stop-mask expansion 4mil, vias tented up to drill 0mil, thermal gap 10mil
Holes 3 mm at 2.98,2.74 3.05,37.59 68.12,2.93 68.1,37.63 26.92,37.59 27.14,2.84 33.78,37.59 33.98,2.96 3.05,45.59 3.05,77.59 99.92,77.62 100,56.58

### Footprints (pad centres in the part's own frame; a part is rotated, then mirrored left to right if it is on the bottom)
22-23-2021 = drill 1 long: 1 -1.27,0; 2 1.27,0
MSTBV2 = drill 1.397 long: 1 -2.54,0; 2 2.54,0
22-03-5035 = drill 0.8: P$1 -2.5,0; P$2 0,0; P$3 2.5,0
22-23-2081 = drill 1 long: 1 -8.89,0; 2 -6.35,0; 3 -3.81,0; 4 -1.27,0; 5 1.27,0; 6 3.81,0; 7 6.35,0; 8 8.89,0
C0603 = smd 1.1 x 1: 1 -0.85,0; 2 0.85,0
C1206 = smd 1.6 x 1.8: 1 -1.4,0; 2 1.4,0
C0805 = smd 1.3 x 1.5: 1 -0.95,0; 2 0.95,0
C1812 = smd 1.9 x 3.4: 1 -1.95,0; 2 1.95,0
C1210 = smd 1.6 x 2.7: 1 -1.4,0; 2 1.4,0
QFN-24 = smd 2 x 0.25: 1 -2.6,1.25; 2 -2.6,0.75; 3 -2.6,0.25; 4 -2.6,-0.25; 5 -2.6,-0.75; 6 -2.6,-1.25; 13 2.6,-1.25; 14 2.6,-0.75; 15 2.6,-0.25; 16 2.6,0.25; 17 2.6,0.75; 18 2.6,1.25 | smd 0.25 x 2: 7 -1.25,-2.6; 8 -0.75,-2.6; 9 -0.25,-2.6; 10 0.25,-2.6; 11 0.75,-2.6; 12 1.25,-2.6; 19 1.25,2.6; 20 0.75,2.6; 21 0.25,2.6; 22 -0.25,2.6; 23 -0.75,2.6; 24 -1.25,2.6 | drill 1.5 pad 1.93 square: THERMAL 0,0
SOT23 = smd 1 x 1.4: 1 -0.95,-1.1; 2 0.95,-1.1; 3 0,1.1
SOD123 = smd 1.4 x 1.4: A 1.9,0; C -1.9,0
SPC4078 = drill 0.8 pad 2.184 long: 1 -3,0; 2 0,-4.8 | drill 1 pad 2.184 long: 3 3,0
22-23-2041 = drill 1 long: 1 -3.81,0; 2 -1.27,0; 3 1.27,0; 4 3.81,0
TSSOP-14-0.65MM = smd 2.5 x 0.35: 1 -3.25,1.95 | smd 2.5 x 0.3: 2 -3.25,1.3; 3 -3.25,0.65; 4 -3.25,0; 5 -3.25,-0.65; 6 -3.25,-1.3; 7 -3.25,-1.95; 8 3.25,-1.95; 9 3.25,-1.3; 10 3.25,-0.65; 11 3.25,0; 12 3.25,0.65; 13 3.25,1.3; 14 3.25,1.95
JP2 = drill 0.914 long: 1 -2.54,0; 2 0,0; 3 2.54,0
TO252 = smd 1 x 1.6: 1 -2.28,-4.8; 2 2.28,-4.8 | smd 5.4 x 6.2: 3 0,2.5
SOT223 = smd 1.5 x 2: 1 -2.3,-3.15; 2 0,-3.15; 3 2.3,-3.15 | smd 3.8 x 2: 4 0,3.15
SO14 = smd 0.66 x 2.032: 1 -3.81,-3.073; 2 -2.54,-3.073; 3 -1.27,-3.073; 4 0,-3.073; 5 1.27,-3.073; 6 2.54,-3.073; 7 3.81,-3.073; 8 3.81,3.073; 9 2.54,3.073; 10 1.27,3.073; 11 0,3.073; 12 -1.27,3.073; 13 -2.54,3.073; 14 -3.81,3.073
5050CE = smd 3.3 x 3.3: P$1 -5.7,0; P$2 5.7,0
CHIP-LED0603 = smd 0.8 x 0.8: A 0,-0.75; C 0,0.75
2X08 = drill 1.016 octagon: 1 -8.89,-1.27; 2 -8.89,1.27; 3 -6.35,-1.27; 4 -6.35,1.27; 5 -3.81,-1.27; 6 -3.81,1.27; 7 -1.27,-1.27; 8 -1.27,1.27; 9 1.27,-1.27; 10 1.27,1.27; 11 3.81,-1.27; 12 3.81,1.27; 13 6.35,-1.27; 14 6.35,1.27; 15 8.89,-1.27; 16 8.89,1.27
2X14 = drill 1.016 octagon: 1 -16.51,-1.27; 2 -16.51,1.27; 3 -13.97,-1.27; 4 -13.97,1.27; 5 -11.43,-1.27; 6 -11.43,1.27; 7 -8.89,-1.27; 8 -8.89,1.27; 9 -6.35,-1.27; 10 -6.35,1.27; 11 -3.81,-1.27; 12 -3.81,1.27; 13 -1.27,-1.27; 14 -1.27,1.27; 15 1.27,-1.27; 16 1.27,1.27; 17 3.81,-1.27; 18 3.81,1.27; 19 6.35,-1.27; 20 6.35,1.27; 21 8.89,-1.27; 22 8.89,1.27; 23 11.43,-1.27; 24 11.43,1.27; 25 13.97,-1.27; 26 13.97,1.27; 27 16.51,-1.27; 28 16.51,1.27
JP1 = drill 0.914 long: 1 0,-1.27; 2 0,1.27
TSSOP-38-0.5MM = smd 2.5 x 0.25: 1 -3.25,4.65; 2 -3.25,4.15; 3 -3.25,3.65; 4 -3.25,3.15; 5 -3.25,2.65; 6 -3.25,2.15; 7 -3.25,1.65; 8 -3.25,1.15; 9 -3.25,0.65; 10 -3.25,0.15; 11 -3.25,-0.35; 12 -3.25,-0.85; 13 -3.25,-1.35; 14 -3.25,-1.85; 15 -3.25,-2.35; 16 -3.25,-2.85; 17 -3.25,-3.35; 18 -3.25,-3.85; 19 -3.25,-4.35; 20 3.25,-4.35; 21 3.25,-3.85; 22 3.25,-3.35; 23 3.25,-2.85; 24 3.25,-2.35; 25 3.25,-1.85; 26 3.25,-1.35; 27 3.25,-0.85; 28 3.25,-0.35; 29 3.25,0.15; 30 3.25,0.65; 31 3.25,1.15; 32 3.25,1.65; 33 3.25,2.15; 34 3.25,2.65; 35 3.25,3.15; 36 3.25,3.65; 37 3.25,4.15; 38 3.25,4.65
SM77H = smd 1.6 x 1.5: 1 -2.55,-1.9; 2 2.55,-1.9; 3 2.55,1.9; 4 -2.55,1.9
R0603 = smd 1 x 1.1: 1 -0.85,0; 2 0.85,0
R1206 = smd 1.6 x 1.803: 1 -1.422,0; 2 1.422,0
R2010 = smd 1.8 x 2.7: 1 -2.2,0; 2 2.2,0
R0805 = smd 1.3 x 1.5: 1 -0.95,0; 2 0.95,0
22-23-2031 = drill 1 long: 1 -2.54,0; 2 0,0; 3 2.54,0
SOIC127P600X175-8N = smd 1.6 x 0.559: 1 -2.642,1.905; 2 -2.642,0.635; 3 -2.642,-0.635; 4 -2.642,-1.905; 5 2.642,-1.905; 6 2.642,-0.635; 7 2.642,0.635; 8 2.642,1.905
TSSOP-20-0.65MM = smd 0.3 x 1.8: P$1 -2.925,-3; P$2 -2.275,-3; P$3 -1.625,-3; P$4 -0.975,-3; P$5 -0.325,-3; P$6 0.325,-3; P$7 0.975,-3; P$8 1.625,-3; P$9 2.275,-3; P$10 2.925,-3; P$11 2.925,3; P$12 2.275,3; P$13 1.625,3; P$14 0.975,3; P$15 0.325,3; P$16 -0.325,3; P$17 -0.975,3; P$18 -1.625,3; P$19 -2.275,3; P$20 -2.925,3
22-23-2061 = drill 1 long: 1 -6.35,0; 2 -3.81,0; 3 -1.27,0; 4 1.27,0; 5 3.81,0; 6 6.35,0
PUSHBUTTON = smd 2.184 x 1.067: P$1 -4.55,2.25; P$2 4.55,2.25; P$3 -4.55,-2.25; P$4 4.55,-2.25

### Placement (x,y rotation side)
5V_FPGA  92.5,10.12 270 top
5V_IN  84.88,10.12 270 top
5V_IN1  8.24,36.07 0 top
12V_IN  59.81,5.41 0 top
AX12-1  60.58,30.3 0 top
AX12-2  60.58,24.71 0 top
AX12-3  60.58,19.12 0 top
AX12-4  60.58,13.54 0 top
AX12-COMM  61.85,36.14 0 top
BAT  87.79,75.87 180 top
BAT-CELL  48.82,45.86 0 top
BAT_TEMP  9.02,76.26 0 top
C1  90.47,15.14 180 top
C2  2.4,16.3 90 top
C3  3.3,12.95 180 top
C4  95.55,35.71 90 bottom
C5  40.89,17.27 180 top
C6  50.8,17.27 180 top
C7  49.53,2.79 90 top
C8  11.38,16.4 0 top
C9  2.77,33.67 90 top
C10  2.38,21.21 270 top
C11  7.55,71.03 90 bottom
C12  14.01,72.6 0 bottom
C13  26.94,61.53 270 bottom
C14  27.72,66.7 0 top
C15  25.5,64.56 0 top
C16  16.73,58.03 270 bottom
C17  19.6,59.2 235 bottom
C18  19.09,46.99 0 bottom
C19  27.35,76.56 270 top
C20  31.48,76.56 270 top
C21  26.34,67.88 270 bottom
C22  33.55,53.13 270 bottom
C23  57.45,76.38 270 top
C24  53.29,76.37 270 top
C25  27.46,54.67 270 bottom
C26  31.94,48.52 270 bottom
C27  32.01,45.28 90 bottom
C28  15.45,61.63 135 bottom
C29  84.65,64.51 270 bottom
C30  78.89,58.11 180 bottom
C31  76.75,75.94 270 bottom
C32  74.53,75.92 270 bottom
C33  77,65.39 270 bottom
C34  66.41,56.83 180 bottom
C36  66.91,59.93 180 bottom
C39  43.13,61.95 180 bottom
C40  43.13,59.88 180 bottom
C50  82.27,60.96 270 bottom
C51  82.28,57.89 90 bottom
CCCAP  79.92,76.09 90 bottom
CDCAP  46.66,67.94 180 bottom
CHARGER  24.64,55.32 270 top
CVC2  57.97,54.33 0 bottom
CVC3  54.83,54.38 0 bottom
CVC4  51.73,54.34 0 bottom
CVC5  48.62,54.38 0 bottom
CVC6  45.51,54.39 0 bottom
CVC7  42.41,54.4 0 bottom
CVC8  39.33,54.37 0 bottom
CVREG  63.56,67.79 0 bottom
D1  30.68,52.85 90 bottom
D2  65.24,71.81 90 bottom
DC_IN  5.01,63.38 90 top
DC_IN2  6.87,53.11 0 top
ENCODER1  79.8,43.33 0 top
ENCODER2  79.8,34.95 0 top
ENCODER3  79.8,26.06 0 top
ENCODER4  79.8,17.67 0 top
GAUGE  75.76,71.14 0 bottom
I2C_PGM  62.27,53.35 0 top
I2C_SELECT  71.1,61.73 90 top
IC1  39.37,10.67 0 top
IC2  49.53,10.67 0 top
IC3  5.26,28.09 270 top
IC4  90.33,66.73 180 bottom
L1  50.37,57.15 90 top
LED1  16.41,59.66 270 top
LED2  16.33,55.53 270 top
LED3  16.27,57.56 270 top
OUT  45.31,75.82 180 top
P1  83.61,50.19 180 top
P3  83.61,4.47 180 top
P4  98.85,27.33 90 top
PGM_ENABLE  66.57,47.6 180 top
PGM_PWR  62.24,45.87 180 top
PROTECTION  56.66,62.23 180 bottom
Q1  11.18,28.79 0 top
Q2  11.53,19.17 270 top
Q3  14.97,66.44 90 top
Q4  17.77,75.53 270 top
Q5  35.42,67.4 180 top
Q6  37.72,55.79 270 top
Q7  32.36,47.35 270 top
Q8  87.07,67.1 90 top
Q9  74.98,73.5 270 top
QG1  91.23,20.73 270 top
R1  81.08,22.34 270 bottom
R2  83.58,22.33 270 bottom
R3  3.5,70.39 0 bottom
R4  14.01,74.7 180 bottom
R5  18.5,61.36 180 top
R6  27.08,69.9 180 top
R7  83.61,13.95 270 bottom
R8  81.1,13.95 270 bottom
R9  29.08,61.52 90 bottom
R10  13.32,59.69 180 top
R11  10.67,24.99 180 top
R12  10.67,22.91 180 top
R13  13.32,55.5 180 top
R14  13.34,57.61 180 top
R15  23.13,46.27 270 bottom
R16  11.58,45.93 270 bottom
R17  13.45,54.67 90 bottom
R18  27.19,45.46 90 bottom
R19  14.71,47.25 0 bottom
R20  13.45,50.46 90 bottom
R21  19.2,49.06 0 bottom
R22  17.22,51.23 0 bottom
R23  28.56,67.91 270 bottom
R24  30.85,65.62 90 bottom
R25  48.64,68.02 270 top
R26  12.2,65.29 90 bottom
R27  14.34,65.29 270 bottom
R28  16.53,65.31 270 bottom
R29  66.27,55.8 90 top
R30  66.77,53.18 180 top
R31  95.9,77.67 90 top
R32  100.15,72.54 90 top
R33  100.61,69.96 0 top
R34  100.61,67.87 0 top
R35  100.61,65.76 0 top
R36  62.8,58.46 270 bottom
R37  93.36,66.99 270 top
R38  67.43,74.51 180 top
R39  58.05,73.84 325 bottom
R40  100.61,63.66 0 top
R41  100.14,61.08 270 top
R42  96.07,57.63 270 top
R43  65.38,71.7 180 top
R44  55.18,65.89 90 top
R45  57.47,68.8 0 top
R46  58.29,71.46 180 top
R47  66.81,68.86 180 top
R48  64.19,68.61 90 top
R49  79.18,65.35 270 bottom
R50  82.69,68.57 90 bottom
R51  84.95,68.63 270 bottom
R52  3.5,72.56 0 bottom
RA  10.41,12.95 0 top
RB  6.86,12.95 0 top
RCPCKN  82.07,76.85 90 bottom
RDPCKN  59.87,69.94 0 bottom
RLDRM_DET  62.92,71.32 270 bottom
RVC2  58.45,50.73 270 bottom
RVC3  55.99,50.73 270 bottom
RVC4  53.36,50.74 270 bottom
RVC5  50.24,50.76 270 bottom
RVC6  47.09,50.77 270 bottom
RVC7  44.02,50.74 270 bottom
RVC8  41.3,50.75 270 bottom
RVC9  38.83,50.76 270 bottom
SERVO1  40.39,28.96 0 top
SERVO2  40.39,21.84 0 top
SERVO3  50.29,28.96 0 top
SERVO4  50.29,21.84 0 top
SERVO_PWM  45.47,36.07 0 top
SOC_LED1  97.88,73.13 90 top
SOC_LED2  97.87,71.35 90 top
SOC_LED3  97.88,69.56 90 top
SOC_LED4  97.9,67.78 90 top
SOC_LED5  97.89,65.96 90 top
SOC_LED6  97.88,64.17 90 top
SOC_LED7  97.87,62.37 90 top
SOC_LED8  97.88,60.56 90 top
U1  6.35,18.29 270 top
U$1  91.3,37.15 180 bottom
U$2  90.8,59.36 270 top
US_1  20.83,31.75 0 top
US_2  20.83,24.13 0 top
US_3  20.83,16.26 0 top
US_4  20.83,8.73 0 top
US_OUTPUT  6.86,8.67 0 top
VIEW_SOC  76.03,61.9 90 top

### Tracks (layer width: path | path; a pad name or v marks a point on that pad's centre or on a via)
3.3VCC
  Top 0.406: 9.94,15.18 8.23,15.2 8.23,15.65 U1.8 8.24,16.76 4.43,19.37 U1.4 4.45,23.44 | 9.94,15.18 9.95,16.4 C8.1 | 9.94,15.18 10.46,15.2 11.57,14.09 11.57,12.96 RA.2 | 9.94,15.18 9.94,17.76 9.94,18.23 9.94,18.22 Q2.2 | 4.45,23.44 2.11,23.43 IC3.3 5.23,25.79 5.25,29.84 7.93,32.51 10.82,32.51 13.64,35.31 23.88,35.31 24.64,34.29 US_1.5 24.64,30.99 20.89,27.18 16.33,27.18 12.14,27.19 Q1.2 | C10.1 2.38,23.43 | 2.38,23.43 | 2.38,23.43 4.44,23.48 4.45,23.44
  Bottom 0.406: US_1.5 US_2.5 US_3.5 US_4.5
5VCC
  Top 0.406: 5V_IN1.1 6.97,35.07 4.47,31.85 2.77,31.86 | 2.77,31.86 IC3.1 | 2.77,31.86 2.77,32.78 C9.1
DC_IN  (via drill 0.5)
  Top 0.406: R13.2 12.51,58.12 R14.2 12.49,60.2 R10.2 9.92,60.23 v9.87,60.27
  Top 1.676: DC_IN.2 5.36,65.21 Q3.3
  Bottom 1.016: R3.2 3.41,66.44 DC_IN.2
  Bottom 1.422: R52.2 1.98,70.58 R3.2
  Bottom 1.676: DC_IN.2 9.87,61.2 v9.87,60.27 DC_IN2.3
GND
  Top 0.406: QG1.2 89.2,17.28 89.2,15.14 C1.2
  Bottom 0.406: 5V_FPGA.2 5V_IN.2
  pour Bottom (isolate 0.305): 102.64,53.29 72.82,53.3 72.74,0.71 102.66,0.66
  pour Top (isolate 0.406): 102.64,53.29 102.66,0.66 72.73,0.72 72.82,53.3
GND2  (via drill 0.5)
  other vias: 8.42,19.08 4.52,34.27
  pour Bottom (isolate 0.406): 29.46,36.58 29.46,3.81 0.25,3.81 0.25,36.58
  pour Top (isolate 0.406): 29.46,36.58 0.25,36.58 0.25,3.81 29.46,3.81
GND3
  Top 0.813: C5.2 37.85,17.27 | C6.2 47.75,17.27 | 48.65,13.17 47.5,12.02 47.5,10.41 44.96,10.41 44.96,4.83 43.94,3.81 39.37,3.81 IC1.3 | 57.27,5.66 54.99,3.88 49.53,3.81 | 49.53,3.81 IC2.3 | C7.2 49.53,3.81
  Top 1.422: AX12-1.P$1 AX12-2.P$1 AX12-3.P$1 AX12-4.P$1 58.08,10.02 57.27,9.22 57.27,5.66 12V_IN.1 | SERVO3.1 SERVO4.1 47.75,17.27 47.75,13.42 48.65,13.17 IC2.3 | SERVO1.1 SERVO2.1 37.85,17.27 37.85,13.68 IC1.3
GND4  (via drill 0.5, 1.5)
  Top 0.254: 26.03,50.12 25.39,50.76 CHARGER.17 25.39,54.58 CHARGER.THERMAL
  Top 0.406: R44.2 55.16,69.29 R46.2 | 26.03,50.12 26.03,48.27 26,45.09 Q7.2
  Top 0.813: v21.01,61.59 23.01,63.73 v23.01,64.52 23.05,64.56 C15.1 | v25.1,46.26 20.22,49.17 v15.94,49.22 20.14,49.22 v20.14,51.51 | DC_IN2.2 10.47,44.92 25.32,44.88 Q7.2
  Top 1.676: v61.27,77.17 61.29,78.32 C23.1 53.57,78.25 C24.1 50.28,78.28 OUT.1 | v52.98,71.6 55.03,71.42 R46.2
  Bottom 0.813: C11.2 7.54,76.05 BAT_TEMP.1
  Bottom 1.676: v61.27,77.17 55.72,76.26 v52.98,71.6 | 3.86,53.13 DC_IN2.1 3.87,50.73 DC_IN2.2
  pour Bottom (isolate 0.406): 9.99,42.31 34.21,42.4 33.78,68.77 10.34,68.48 9.97,45.52
  pour Top (isolate 0.406): 0.42,42.25 7.94,42.25 7.93,75.42 43.95,75.58 43.89,75.59 49.49,75.55 49.56,78.98 0.58,78.92
GND5  (via drill 0.5)
  Top 0.406: 91.44,71.84 91.52,71.58 94.58,71.57 94.59,62.54 90.83,62.54 90.82,59.4 | 90.82,59.4 U$2.2 83.95,59.35 v83.8,59.35 83.36,60.01 v79.64,60.01 | R37.1 93.34,69.38 Q8.2 | v82.12,74.68 86.49,71.57 91.5,71.55 | 90.82,59.4 93.91,59.4 U$2.4 | v67.65,62.42 v64.74,62.17 | v45.19,65.79 v42.41,64.4
  Top 1.676: BAT.1 91.5,71.55 91.44,71.84 Q8.2
  Bottom 0.254: PROTECTION.23 61.04,65.08 61.04,64.59 PROTECTION.24 61.06,64.58 61.05,64.08 | 61.05,64.08 PROTECTION.25 | 64.29,62.05 63.45,61.48 61.71,61.73 61.35,62.08 PROTECTION.29 57.51,62.08 56.74,62.59 55.34,62.58 PROTECTION.11 51.68,62.59 50.22,63.04 | v64.74,62.17 64.73,62.26 | 64.46,63.87 62.68,64.07 61.05,64.08
  Bottom 0.406: C40.1 42.23,61.33 C39.1 42.27,63.15 | v82.12,74.68 82.09,75.28 RCPCKN.1 82.1,74.69 CCCAP.1 79.06,75.26 77.29,76.72 C31.1 C32.1 73.61,76.79 72.51,75.87 GAUGE.14 | C29.1 84.95,65.67 R51.2 84.95,67.12 96.2,67.13 97.11,67.42 97.11,68.89 | C51.2 82.27,59.37 | 82.27,59.37 C50.2 | C33.2 77,62.56 75.54,60.56 75.55,58.16 | 75.55,58.16 75.9,58.14 76.7,58.14 77.75,58.14 C30.1 79.06,59.42 v79.64,60.01 | PGM_PWR.1 63.51,49.53 67.81,53.82 67.81,57.19 | 67.81,57.19 67.81,57.68 C34.2 68.24,59.93 C36.2 v67.65,62.42 | IC4.7 94.84,69.8 95.2,69.39 96.67,68.89 97.11,68.89 | 97.11,68.89 97.11,73.16 95.07,74.88 91.35,74.85 BAT.1 | v83.8,59.35 82.32,59.38 82.27,59.37 | 75.55,58.16 73.6,58.14 73.59,57.62 73.16,57.19 67.81,57.19 | 64.73,62.26 64.46,63.87 CVREG.1 RLDRM_DET.2 | v64.74,62.17 64.29,62.05 | 50.22,63.04 44.52,63.15 42.27,63.15 | CDCAP.1 v45.19,65.79 | v42.41,64.4 42.27,63.15
N$1
  Top 0.305: QG1.3 94.43,18.18 95.62,19.37 95.62,25.41 96.27,26.06 P4.14
N$2  (via drill 0.5)
  Top 0.305: P4.23 98.85,37.49 95.04,37.49 95.04,32.44 94.99,32.34 v94.67,31.89
  Bottom 0.305: v94.67,31.89 93.58,32.64 U$1.P$12
N$3  (via drill 0.5)
  Top 0.305: P4.21 98.85,34.95 98.85,30.12 98.6,29.87 96.82,29.87 96.41,29.56 91.64,29.56 91.2,29.56 v90.46,30.3
  Bottom 0.305: v90.46,30.3 90.97,30.85 U$1.P$16
N$4  (via drill 0.5)
  Top 0.305: P4.15 98.85,27.33 91.99,27.33 88.86,30.41 v88.28,30.95
  Bottom 0.305: U$1.P$18 89.68,32.15 88.65,31.26 88.71,31.25 v88.28,30.95
N$5  (via drill 0.5)
  Top 0.305: P4.22 95.8,36.22 95.8,31.78 95.82,31.75 94.78,30.65 v93.03,30.67
  Bottom 0.305: v93.03,30.67 92.28,31.32 U$1.P$14
N$6  (via drill 0.5)
  Top 0.305: P1.4 88.68,47.74 v88.67,42.86
  Bottom 0.305: v88.67,42.86 89.66,41.89 89.67,41.88 U$1.P$3
N$7  (via drill 0.5)
  Top 0.305: P1.2 92.5,48.85 93.32,48 93.31,44.56 v93.32,43.72
  Bottom 0.305: v93.32,43.72 92.27,42.76 92.28,41.94 U$1.P$7
N$8
  Bottom 0.305: P1.1 94.89,49.64 94.9,44.27 94.88,42.79 93.58,41.72 93.58,40.72 U$1.P$9
N$9  (via drill 0.5)
  Top 0.305: P1.3 91.21,50.21 91.21,47.77 91.21,45.18 v91.23,44.54
  Bottom 0.305: U$1.P$5 90.97,40.66 90.97,40.79 90.98,44.02 v91.23,44.54
N$10
  Bottom 0.305: U$1.P$17 90.31,32.86 90.31,31.5 86.86,28.35 85.1,28.35 82.34,28.35 81.07,27.08 ENCODER3.3 81.07,23.2 R1.1
N$11
  Bottom 0.305: U$1.P$15 91.64,32.87 91.59,29.14 88.36,26.06 ENCODER3.4 83.61,23.21 R2.1
N$12
  Top 0.406: R11.2 9.53,25.12 9.52,24.77 9.53,22.56 | 9.53,22.56 8.64,22.56 6.33,22.56 5.74,21.98 5.73,21.75 U1.3 | 9.53,22.56 9.53,22.97 9.53,22.99 R12.2
N$13
  Bottom 1.016: R3.1 5.21,70.22 6.75,69.84 C11.1
  Bottom 1.422: R52.1 R3.1
N$14
  Bottom 0.305: U$1.P$13 92.92,32.88 92.92,31.95 93.92,31.25 93.92,30.2 92.72,29.03 86.86,23.22 86.91,21.74 85.13,19.96 82.34,19.96 81.07,18.69 ENCODER4.3 81.07,14.83 R8.1
N$15
  Bottom 0.305: U$1.P$11 94.23,33.27 95.72,32.5 95.73,30.81 95.33,30.39 88.18,23.23 88.18,20.73 85.13,17.67 ENCODER4.4 R7.1
N$16
  Bottom 0.305: U$1.P$8 92.91,40.93 92.92,42.16 94.26,43.24 94.25,45.01 94.02,45.11 91.4,46.38 82.34,46.38 81.07,44.6 ENCODER1.3
N$17
  Bottom 0.305: U$1.P$6 91.63,40.92 91.63,43.32 92.41,44.01 92.4,44.97 91.25,45.63 85.39,45.6 ENCODER1.4
N$18
  Bottom 0.305: U$1.P$4 90.33,41.27 90.33,41.73 90.3,43.23 90.32,43.25 89.29,44.13 87.11,44.13 86.17,43.2 86.15,41.3 86.15,37.74 85.64,37.24 82.09,37.24 81.07,36.22 ENCODER2.3 81.08,34.94
N$19
  Bottom 0.305: U$1.P$2 89.02,40.92 89.02,41.23 88.33,41.76 87.47,41.75 86.93,41.21 86.91,40.04 86.91,37.49 84.37,34.95 ENCODER2.4
N$20  (via drill 0.5)
  Top 0.406: RB.1 5.06,12.95 | 5.06,12.95 C3.1 | 5.06,12.95 5.06,13.95 5.05,13.93 5.72,14.85 U1.6 5.72,16.98 v4.97,17.63 | U1.2 6.99,20.17 6.99,19.51 v6.79,19.13
  Bottom 0.406: v6.79,19.13 v4.97,17.63
N$21
  Top 0.406: U1.5 4.45,15.07 2.4,15.07 C2.1
N$22
  Top 0.406: RB.2 8.65,12.95 | 8.65,12.95 RA.1 | U1.7 6.98,14.83 7.5,14.18 8.65,14.17 8.65,12.95
N$23
  Top 0.406: R12.1 11.81,23 11.8,21.59 9.94,21.1 9.94,21.09 9.92,20.11 Q2.1
N$24
  Top 0.406: Q1.1 10.23,26.91 11.79,26.12 11.79,25.59 R11.1
N$25
  Bottom 0.406: US_1.2 17.02,28.7 15.75,27.43 11.43,27.43 3.05,19.05 US_OUTPUT.1
N$26
  Bottom 0.406: US_2.2 17.02,21.08 15.75,19.81 11.18,19.81 5.59,14.22 US_OUTPUT.2
N$27
  Bottom 0.406: US_3.2 17.02,14.48 14.99,11.94 9.91,11.94 8.13,10.16 US_OUTPUT.3 8.13,8.64
N$28
  Bottom 0.406: US_4.2 17.03,7.17 16.33,6.09 11.76,6.09 10.65,7.13 US_OUTPUT.4
N$29
  Bottom 0.406: US_1.4 22.1,29.21 19.56,26.67 US_2.3
N$30
  Bottom 0.406: US_3.4 22.1,13.21 19.56,11.18 US_4.3
N$31
  Top 0.406: US_1.3 19.56,30.99 18.03,29.46 13.46,29.46 12.97,29.47 12.58,29.88 12.09,30.4 11.18,30.41 Q1.3
N$32
  Top 0.406: US_3.3 19.56,17.78 18.28,19.18 17.84,19.18 13.26,19.17 Q2.3
N$33
  Top 0.813: SERVO_PWM.1 41.66,33.53 42.93,32.26 SERVO1.3
N$34
  Top 0.813: SERVO_PWM.2 44.2,34.04 44.96,33.27 44.96,23.62 SERVO2.3
N$35
  Top 0.813: SERVO_PWM.3 46.74,34.8 52.83,30.48 SERVO3.3
N$36
  Top 0.813: SERVO3.2 SERVO4.2 50.29,19.05 53.34,19.05 53.34,17.27 | 53.34,17.27 53.34,8.38 51.82,6.86 51.82,6.13 IC2.2 | C6.1 53.34,17.27
N$37
  Top 0.813: SERVO4.3 55.37,23.6 55.37,31.98 SERVO_PWM.4
N$38
  Top 0.813: 12V_IN.2 62.35,1.85 49.28,1.78 | 49.28,1.78 47.25,1.78 IC2.1 47.24,1.8 46.74,1.78 37.09,1.78 IC1.1 | C7.1 49.28,1.94 49.28,1.78
  Top 1.422: 12V_IN.2 62.35,7.44 60.58,10.23 AX12-4.P$2 AX12-3.P$2 AX12-2.P$2 AX12-1.P$2
N$39
  Top 0.813: IC1.2 41.65,6.85 43.18,8.38 43.18,17.27 | 43.18,17.27 43.18,19.05 40.39,19.05 SERVO2.2 SERVO1.2 | C5.1 43.18,17.27
N$40
  Top 0.813: AX12-4.P$3 AX12-3.P$3 | AX12-1.P$3 63.16,36.1 AX12-COMM.2 AX12-COMM.1 | AX12-1.P$3 AX12-2.P$3 AX12-3.P$3 | AX12-3.P$3 AX12-1.P$3
N$41  (via drill 0.5)
  Top 0.406: v24.31,66.35 20.47,66.86 Q3.2
  Top 1.676: Q4.2 12.94,71.02 v14.95,70.97 19.75,70.95 Q3.2
  Bottom 0.406: R4.2 14.88,73.32 C12.1 v14.95,70.97 | R9.2 29.05,64.9 25.1,64.9 v24.31,66.35
N$42  (via drill 0.5)
  Top 0.406: v12.97,76.35 12.97,77.18 Q4.1 | v19.58,65.8 19.77,64.98 Q3.1 17.64,63.06 R5.2
  Bottom 0.406: v12.97,76.35 13,75.48 R4.1 13.14,73.62 C12.2 13.15,69.38 18.65,68.27 19.57,65.78 v19.58,65.8
N$43
  Top 0.254: CHARGER.3 24.93,60.11 25.19,60.84
  Top 0.406: 25.19,60.84 24.73,61.43 23.92,61.64 23.2,61.34 22.77,60.61 19.73,60.59 R5.1
N$44  (via drill 0.5)
  Top 0.254: CHARGER.7 21.02,56.58 v20.67,57.34
  Bottom 0.406: v20.67,57.34 20.3,58.14 C17.2
N$45  (via drill 0.5)
  Top 0.254: CHARGER.24 28.18,56.58 v28.92,57.9
  Bottom 0.406: v28.92,57.9 v28.91,57.9 C13.2 28.38,60.12 R9.1
N$46  (via drill 0.5)
  Top 0.254: CHARGER.1 25.89,58.89 26.61,59.61
  Top 0.406: R6.1 28.63,69.76 28.56,69.63 C14.2 28.55,61.59 26.61,59.61
  Top 1.676: R6.1 30.47,69.94 30.47,70.05 | 30.47,70.05 v30.46,67.72 30.47,74.7 31.4,74.7 C20.2 | OUT.2 42.2,74.61 32.98,74.61 | Q6.3 37.99,58.26 37.98,60.25 30.47,60.17 30.47,70.05 | 32.98,74.61 C20.2 | C19.2 C20.2 | Q5.2 33.14,74.45 32.98,74.61
  Bottom 0.305: R23.1 28.56,69.49 29.14,70.07 30.5,70.07 v30.46,67.72
  Bottom 0.406: R23.1 C21.1
N$47  (via drill 0.5)
  Top 0.254: CHARGER.12 20.97,54.08 v20.23,53.33
  Bottom 0.406: C18.2 18.13,47.23 18.12,48.4 R21.2 18.18,49.27 R22.1 18.62,51.96 19.21,52.52 19.36,52.66 v20.23,53.33
N$48
  Top 0.254: CHARGER.5 23.88,59.36 23.21,59.78
  Top 0.406: LED1.C 21.85,59.78 23.21,59.78
N$49
  Top 0.254: CHARGER.9 19.73,55.58 19.14,56.16
  Top 0.406: 19.14,56.16 17.38,56.16 LED2.C
N$50
  Top 0.254: CHARGER.8 20.34,56.08 19.69,56.72
  Top 0.406: LED3.C 19.12,57.15 19.69,56.72
N$51
  Top 0.406: R10.1 15.26,59.66 LED1.A
N$52
  Top 0.406: LED2.A 14.27,55.52 R13.1
N$53
  Top 0.406: LED3.A 14.56,57.6 R14.1
N$54
  Bottom 0.406: R28.1 14.42,66.15 R27.1 R26.2 | BAT_TEMP.2 10.28,68.24 11.05,66.14 R26.2 | R26.2
N$55  (via drill 0.5)
  Top 0.254: CHARGER.16 24.89,50.02 v24.92,48.76
  Bottom 0.406: R15.1 23.01,47.65 25.11,47.66 | 25.11,47.66 27.17,47.66 R18.2 | v24.92,48.76 v24.91,48.77 24.91,47.67 25.11,47.66
N$56  (via drill 0.5)
  Top 0.254: CHARGER.15 24.39,50.02 v23.7,48.96
  Bottom 0.406: R16.1 13.7,46.7 | 13.7,46.7 R19.2 | v23.7,48.96 21.54,48.84 21.54,45.76 13.66,45.82 13.7,46.7
N$57  (via drill 0.5)
  Top 0.254: CHARGER.11 19.98,54.58 v18.89,53.73
  Bottom 0.406: R20.2 13.45,52.46 | 13.45,52.46 R17.1 | v18.89,53.73 15.63,53.76 14.47,52.59 13.53,52.54 13.45,52.46
N$58  (via drill 0.5)
  Top 0.406: v60.57,68.48 61.92,66.69 71.31,66.69 71.32,69.48 74.88,69.49 74.88,72.87 77.8,72.87 Q9.3 | 82.47,69.5 82.18,70.12
  Top 1.676: Q8.3 82.18,70.12 Q9.3
  Bottom 0.406: RDPCKN.1 60.65,69.17 v60.57,68.48
N$59  (via drill 0.5)
  Top 0.254: CHARGER.6 23.39,58.97 v22.21,58.74
  Bottom 0.254: PROTECTION.13 51.55,63.58 51.54,63.87 | 51.54,63.87 51.53,63.84 51.57,64.08 PROTECTION.14 | 51.54,63.87 50.32,63.92
  Bottom 0.406: v22.21,58.74 22.22,62.8 22.17,62.77 | 22.17,62.77 16.56,62.79 | 16.56,62.79 R28.2 | 16.56,62.79 16.41,62.57 C28.2 | 50.32,63.92 46.1,63.96 43.38,65.56 43.4,72.03 42.59,72.84 38.85,72.84 37.69,74 35.33,74 28.51,74.01 23.37,73.48 21.59,71.39 21.59,66.61 21.59,62.79 22.17,62.77
N$60  (via drill 0.5)
  Top 0.406: v35.63,72.2 Q5.1
  Bottom 0.305: v35.63,72.2 24.63,72.2 23.33,70.9 23.33,68.85 25.05,67.13 26.23,67.13 C21.2
  Bottom 0.406: R24.2 R23.2 C21.2
N$61  (via drill 0.5)
  Top 0.406: v68.9,68.84 67.73,68.84 R47.1
  Bottom 0.305: 74.56,73.39 74.01,72.44 GAUGE.13 69.79,72.44 68.86,71.51
  Bottom 0.406: 74.56,73.39 C32.2 | 68.86,71.51 68.86,68.88 v68.9,68.84
N$62  (via drill 0.5)
  Top 0.254: CHARGER.23 28.75,56.08 v29.35,56.68
  Bottom 0.406: v29.35,56.68 30.89,59.11 30.85,63.55 R24.1
N$63
  Top 0.254: CHARGER.21 29.52,55.08 29.79,54.8
  Top 0.406: Q6.1 32.92,56.91 30.33,54.8 29.79,54.8
N$64  (via drill 0.5)
  Top 0.254: CHARGER.20 28.86,54.58 29.91,53.67
  Top 0.406: 29.91,53.67 33.05,50.97 | v32.94,55.52 Q6.2
  Top 1.676: Q7.3 33.04,46.8 33.05,50.97 32.98,51.61 | 32.98,51.61 Q6.2 | L1.P$1 49.79,51.64 32.98,51.61
  Bottom 0.406: C22.1 33.54,54.65 v32.94,55.52
N$65  (via drill 0.5)
  Top 0.254: CHARGER.22 29.43,55.58 v30.38,56.04
  Bottom 0.406: v30.38,56.04 31.78,54.8 D1.3 32.37,52.31 C22.2
N$66
  Bottom 0.254: PROTECTION.31 61.54,61.08 62.71,60.68
  Bottom 0.406: 62.71,60.68 65.39,60.17 65.31,60.25 C36.1 | C36.1 65.4,58.96 C34.1 | C36.1 65.78,61.22 65.72,69.33 D2.C
N$67  (via drill 0.5)
  Top 0.254: CHARGER.14 23.89,50.79 v23.25,50.15
  Top 0.406: v42.16,67.23 47.19,67.24 R25.2
  Top 1.676: L1.P$2 50.3,65.48 R25.2
  Bottom 0.406: v23.25,50.15 26,49.83 29.81,47.11 31.99,47.11 | 31.99,47.11 35.86,47.11 35.89,67.2 35.92,67.23 v42.16,67.23 | C27.2 31.98,46.9 C26.2 31.96,46.59 31.99,47.11
N$68
  Bottom 0.406: BAT-CELL.8 RVC2.2
N$69  (via drill 0.5)
  Top 0.254: CHARGER.18 25.89,51.78 v27.24,51.77
  Bottom 0.406: D1.1 27.23,51.73 C25.2 27.26,51.85 v27.24,51.77
N$70
  Top 0.254: CHARGER.19 28.2,54.08 28.35,53.99
  Top 0.406: 28.35,53.99 28.34,51.3 Q7.1
N$71
  Bottom 0.254: PROTECTION.8 50.13,61.09 48.83,60.43
  Bottom 0.406: RVC9.1 38.46,52.28 CVC8.2 38.48,52.99 38.48,55.25 47.64,59.82 48.83,60.43
N$72
  Bottom 0.254: PROTECTION.36 61.81,58.58 62.32,57.49
  Bottom 0.406: RVC2.1 58.77,51.6 CVC2.1 58.84,54.36 62.32,57.49 62.31,57.51 63.02,57.47 R36.2
N$73
  Bottom 0.254: PROTECTION.3 51.72,58.59 51.2,57.49
  Bottom 0.406: CVC4.2 50.23,54.31 50.11,54.35 | 50.11,54.35 CVC5.1 | RVC5.1 50.16,54.41 | 51.2,57.49 50.11,55.97 50.1,55.66 50.15,54.77 50.16,54.41 | 50.16,54.41 50.11,54.35
N$74
  Bottom 0.254: PROTECTION.38 58.69,57.59 58.12,57.08
  Bottom 0.406: CVC2.2 56.41,54.33 56.36,54.73 | 56.36,54.73 CVC3.1 | RVC3.1 56.38,51.71 56.36,54.73 | 58.12,57.08 56.36,54.73
N$75
  Bottom 0.254: PROTECTION.34 62.85,59.58 62.84,59.56
  Bottom 0.406: 62.84,59.56 63.01,59.54 R36.1
N$76
  Bottom 0.254: PROTECTION.6 51.44,60.08 50.08,59.2
  Bottom 0.406: CVC6.2 44.01,54.36 43.98,54.34 | 43.98,54.34 CVC7.1 | RVC7.1 44.02,54.29 43.98,54.34 | 50.08,59.2 44.01,55.27 43.98,54.34
N$77
  Bottom 0.254: PROTECTION.5 51.86,59.58 50.31,58
  Bottom 0.406: CVC5.2 47.01,54.41 47.03,54.46 | 47.03,54.46 47.06,54.3 | 47.06,54.3 CVC6.1 | RVC6.1 47.1,52.53 47.06,54.3 | 50.31,58 47.21,55.86 47.01,55.47 47.03,54.46
N$78
  Bottom 0.254: PROTECTION.1 53.34,56.82
  Bottom 0.406: CVC3.2 53.3,54.41 53.44,54.44 | 53.44,54.44 CVC4.1 | RVC4.1 53.32,54.44 53.44,54.44 | 53.34,56.82 53.26,55.25 53.26,53.01 53.44,54.44
N$79
  Bottom 0.406: RVC3.2 BAT-CELL.7
N$80
  Bottom 0.406: BAT-CELL.6 RVC4.2
N$81
  Bottom 0.406: BAT-CELL.5 RVC5.2
N$82
  Bottom 0.406: RVC6.2 BAT-CELL.4
N$83
  Bottom 0.406: RVC7.2 BAT-CELL.3
N$84
  Bottom 0.406: RVC8.2 BAT-CELL.2
N$85
  Bottom 0.406: BAT-CELL.1 RVC9.2
N$86
  Bottom 0.305: GAUGE.7 79.2,69.02
  Bottom 0.406: R49.1 79.2,69.02 77,66.71 C33.1
N$87  (via drill 0.5)
  Top 0.406: Q9.1 68.39,76.18 v65.81,76.19 66.58,76.19 R38.2
  Bottom 0.406: v65.81,76.19 64.17,76.2 R39.1
N$88  (via drill 0.5)
  Top 0.406: R37.2 93.32,64.83 Q8.1 90.5,63.43 80.78,63.42 80.77,68.1 72.22,68.1 72.22,65.89 62.76,65.89 62.28,65.67 v62.05,65.56
  Bottom 0.254: PROTECTION.21 61.46,66.08 v62.05,65.56
N$89
  Bottom 0.254: PROTECTION.17 51.38,65.58 50.28,67.16
  Bottom 0.406: 50.28,67.16 50.61,68.42 51.75,69 53.06,69.39 54.92,70.37 55.74,72.11 R39.2
N$90
  Bottom 0.254: PROTECTION.16 51.97,65.08 51.96,65.09 49.73,65.12
  Bottom 0.406: 49.73,65.12 CDCAP.2
N$91
  Bottom 0.254: PROTECTION.7 51.11,60.58 49.28,59.64
  Bottom 0.406: CVC7.2 41.09,54.35 40.94,54.31 | 40.94,54.31 CVC8.1 | RVC8.1 40.92,52.52 40.94,54.31 | 49.28,59.64 40.96,55.22 40.94,54.31
N$92
  Bottom 0.254: 51.3,67.54 51.25,66.89 51.91,66.08 PROTECTION.18 55.94,66.08 56.94,67.08
  Bottom 0.406: 51.3,67.54 51.49,67.9 53.03,68.33 55.8,69.55 57.98,71.64 62.35,72.45 RLDRM_DET.1 | RDPCKN.2 57.61,67.79 56.94,67.08
N$93
  Top 0.406: SOC_LED1.A 98.4,73.69 96.8,75.2 R31.1
N$94  (via drill 0.5)
  Top 0.406: v53.39,67.42 51.72,67.34 v50.7,69.69
  Bottom 0.254: PROTECTION.19 53.39,67.4
  Bottom 0.406: 53.39,67.4 v53.39,67.42 | v50.7,69.69 50.7,74.86 54.95,79.11 82.08,79.11 RCPCKN.2
N$95  (via drill 0.5)
  Top 0.406: v63.21,64.9 66.49,64.89 v66.8,64.89
  Bottom 0.254: PROTECTION.20 62.89,66.59 v63.21,64.9
  Bottom 0.406: v66.8,64.89 67.68,74.62 71.7,78.13 79.92,78.1 CCCAP.2
N$96
  Top 0.406: SOC_LED2.A R32.1
N$97  (via drill 0.5)
  Top 0.406: v56.42,60.47 56.41,68.59 R45.1
  Bottom 0.254: 55.95,61.99 55.96,62.08 PROTECTION.10 51.42,62.07 48.97,62.32
  Bottom 0.406: 55.95,61.99 v56.42,60.47 | 48.97,62.32 48.04,62.24 C39.2
N$99  (via drill 0.5)
  Top 0.406: v55.58,59.29 55.19,59.78 R44.1
  Bottom 0.254: v55.58,59.29 55.14,61.59 PROTECTION.9 49,61.59 48.04,61.19
  Bottom 0.406: C40.2 46.99,60.84 48.04,61.19
N$100  (via drill 0.5)
  Top 0.406: v62.28,62.57 62.38,61.32 | 62.38,61.32 62.54,57.4 62.55,55.74 61.03,54.48 I2C_PGM.1 61,52.47 62.53,50.94 64.47,50.94 65.92,52.39 R30.2 | v68.82,63.63 68.81,60.09 62.42,60.13 62.38,61.32
  Bottom 0.254: PROTECTION.27 61.68,63.1 v62.28,62.57
  Bottom 0.305: GAUGE.9 70.67,69.85 70.68,68.28
  Bottom 0.406: 70.68,68.28 71.02,67.3 70.25,66.31 68.89,66.31 v68.82,63.63
N$101
  Top 0.406: I2C_PGM.2 64.4,56.94 66.27,56.93 | 66.27,56.93 66.26,59.2 I2C_SELECT.1 | R29.2 66.27,56.68 66.27,56.93
N$102
  Top 0.406: SOC_LED3.A R33.1
N$103  (via drill 0.5)
  Top 0.406: PGM_ENABLE.2 63.35,48.98 60.05,48.99 58.69,50.54 58.71,55.69 58.72,64.95 v57.69,65.6
  Bottom 0.254: v57.69,65.6 58.51,65.58 PROTECTION.22
N$104  (via drill 0.5)
  Top 0.406: v57.54,64.23 57.78,63.76 57.75,50.05 PGM_PWR.2
  Bottom 0.254: PROTECTION.28 58.3,62.59 v57.54,64.23
N$105  (via drill 0.5)
  Top 0.406: R31.2 96.7,78.1 97.6,75.8 R32.2 101.46,72.7 R33.2 R34.2 R35.2 R40.2 101.46,60.88 R41.2 99.92,59.77 98.07,58.86 96.47,56.6 R42.2 96.05,56.93 96.06,56.5 94.74,56.47 88.53,56.48 U$2.3 85.52,57.08 v83.92,57.04
  Bottom 0.305: GAUGE.6 80.1,69.84 80.1,70.49 GAUGE.5
  Bottom 0.406: IC4.14 C29.2 | 80.1,69.84 81.03,69.83 81.04,59 | 81.04,59 81.05,57.02 C51.1 83.52,57.03 v83.92,57.04 84.85,58.1 84.88,63.64 IC4.14 | C30.2 81.05,58.06 81.04,59 | IC4.14 86.51,61.71 88.95,58.22 96.32,58.22 97.83,59.96 97.83,63.18 97.83,63.45 95,63.46 95,62.44 94.64,62.12 93.31,62.12 92.87,62.42 IC4.9
N$106
  Top 0.406: SOC_LED4.A R34.1
N$107
  Top 0.406: SOC_LED5.A R35.1
N$108
  Top 0.406: R40.1 SOC_LED6.A
N$109
  Top 0.406: R41.1 SOC_LED7.A
N$110
  Top 0.406: R42.1 98.4,59.99 SOC_LED8.A
N$111  (via drill 0.5)
  Top 0.406: v96.05,59.66 96.05,59.68 SOC_LED8.C
  Bottom 0.406: IC4.13 87.81,61.87 89.49,59.23 95.32,59.22 v96.05,59.66
N$112  (via drill 0.5)
  Top 0.406: SOC_LED1.C v95.02,73.45
  Bottom 0.406: v95.02,73.45 94.39,73.08 90.35,73.11 89.07,71.77 IC4.3
N$113  (via drill 0.5)
  Top 0.406: v95.76,72.24 95.92,72.21 SOC_LED2.C
  Bottom 0.406: IC4.4 90.37,71.55 91.11,72.28 95.17,72.28 95.57,72.3 v95.76,72.24
N$114  (via drill 0.5)
  Top 0.406: v95.87,70.47 SOC_LED3.C
  Bottom 0.406: IC4.5 91.62,71.1 91.9,71.38 95.37,71.39 95.87,70.89 v95.87,70.47
N$115  (via drill 0.5)
  Top 0.406: v95.83,68.08 SOC_LED4.C
  Bottom 0.406: IC4.6 92.85,67.95 95.35,67.91 v95.83,68.08
N$116  (via drill 0.5)
  Top 0.406: SOC_LED5.C v95.93,66
  Bottom 0.406: v95.93,66 91.63,66 IC4.10
N$118  (via drill 0.5)
  Top 0.406: SOC_LED7.C 96.8,61.62 96.24,61.4 95.96,60.8 v95.93,60.78
  Bottom 0.406: v95.93,60.78 95.06,60.32 90.04,60.29 89.08,61.95 IC4.12
N$120  (via drill 0.5)
  Top 0.406: v63.56,62.97 67.33,63.73 68.22,64.79 70.79,64.79 I2C_SELECT.3
  Bottom 0.254: PROTECTION.26 62.2,63.58 62.77,63.35 v63.56,62.97
N$121
  Bottom 0.305: GAUGE.8 73.42,69.18 73.42,68.32
  Bottom 0.406: 73.42,68.32 73.39,61.73 I2C_SELECT.2
N$122  (via drill 0.5)
  Top 0.406: R48.1 64.15,67.46 69.7,67.47 v69.81,67.67
  Bottom 0.305: 70.69,71.79 GAUGE.12 74.84,71.79 74.91,71.86
  Bottom 0.406: 70.69,71.79 70.19,71.79 69.8,71.4 v69.81,67.67 | C31.2 76.8,73.75 74.91,71.86
N$123
  Bottom 0.305: GAUGE.3 81.52,71.79 82.12,71.19
  Bottom 0.406: IC4.2 87.79,71.18 86.52,71.18 | 86.52,71.18 IC4.1 | 82.12,71.19 86.51,71.19 86.52,71.18
N$124
  Bottom 0.305: GAUGE.1 82.38,73.09 82.39,73.1
  Bottom 0.406: 82.39,73.1 83.27,74.32 83.28,79.1 91.37,79.05 92.76,77.56 96.05,75.82 98.11,73.62 98.1,64.87 94.19,64.86 94.19,63.66 IC4.8
N$126  (via drill 0.5)
  Top 0.406: 73.8,60.54 VIEW_SOC.P$1 | v77.19,60.53 73.8,60.54 | 73.8,60.54 VIEW_SOC.P$2
  Bottom 0.406: R49.2 78.39,62.25 v77.19,60.53
N$127  (via drill 0.5)
  Top 0.406: v75.4,62.52 78.07,62.55 78.2,62.54 78.28,62.7 | VIEW_SOC.P$4 78.28,64.59 78.28,62.7 | 78.28,62.7 78.3,59.08 VIEW_SOC.P$3
  Bottom 0.305: GAUGE.2 76.85,72.44 75.43,70.78
  Bottom 0.406: 76.79,72.3 75.43,70.78 v75.4,62.52
N$128
  Bottom 0.305: GAUGE.4 81.07,71.14 R50.2
  Bottom 0.406: R50.2 84.91,69.52 R51.1
N$129  (via drill 0.5)
  Top 0.254: CHARGER.13 23.39,51.77 v22.1,51.09
  Top 0.406: v42.13,68.93 47.33,68.94 R25.1 | v63.54,74.55 63.56,74.45 63.64,75.16 | v83.79,61.69 v85.97,60.7 U$2.1 | BAT.2 86.25,75.84 89.4,79 92.85,78.98 v93.44,78.87
  Top 1.676: BAT.2 84.12,77.98 83.94,77.99 84.02,77.98 83.72,78 80.6,78.02 78.18,78.01 64.21,78.04 63.64,75.16 v63.54,74.55 C23.2 C24.2 51.32,74.39 49.89,71.77 48.64,71.78 | 48.64,71.78 R25.1 | Q5.3 37.48,67.1 40.02,67.13 40.03,71.8 48.64,71.78
  Bottom 0.406: C18.1 20.16,47.46 R21.1 20.73,50.13 v22.1,51.09 23.59,51.35 26.4,50.68 28.56,49.71 31.88,49.71 | 31.88,49.71 34.81,49.72 34.84,68.93 v42.13,68.93 | D2.A 65.17,73.99 v63.54,74.55 | R50.1 82.57,62.35 C50.1 83.76,61.68 v83.79,61.69 | v93.44,78.87 96.49,76.67 99.05,74.06 98.98,60.23 97.03,57.33 88.18,57.33 86.01,60.62 v85.97,60.7 | C26.1 31.96,49.33 31.88,49.71
N$130  (via drill 0.5)
  Top 0.406: v59.59,67.47 59.6,64.39 59.53,62.78 59.58,51.47 61.04,49.98 65.34,49.98 PGM_ENABLE.1 67.62,49.92 R30.1 67.62,54.91 R29.1
  Bottom 0.254: PROTECTION.12 54.93,63.09 56.15,65.34 57.16,66.18 58.58,67.47
  Bottom 0.406: 58.58,67.47 v59.59,67.47 61.7,67.47 CVREG.2
N$131
  Top 0.406: R45.2 60.47,69.7 R46.1 | R43.2 64.16,70.11 R48.2
  Top 1.676: R43.2 62.07,71.73 R46.1
N$132
  Top 0.406: R38.1 68.29,72.58 | 68.29,72.58 R43.1 | 68.29,72.58 65.99,69.21 R47.2
  Top 1.676: Q9.2 69.54,71.44 R43.1
SI7617DN
  Top 0.254: CHARGER.2 25.39,59.52 25.93,60.17
  Top 0.406: 25.93,60.17 26.84,61.22 26.86,65 | 26.86,65 C14.1 26.73,67.33 R6.2 | C15.2 26.86,64.55 26.86,65
  Top 1.676: Q4.3 20.3,75.16 22.53,75.17 R6.2
SOC_LED6  (via drill 0.5)
  Top 0.406: SOC_LED6.C 95.97,64.19 v95.96,62.32
  Bottom 0.406: v95.96,62.32 95.52,61.61 94.65,61.12 90.75,61.1 90.33,62.42 IC4.11
VCC3.3  (via drill 0.5)
  Top 0.305: QG1.4 93.13,24.39 86.62,30.9 86.62,31.95 v86.72,32.05
  Top 0.406: QG1.4 91.74,21.12 91.74,15.14 C1.1
  Bottom 0.305: P4.28 95.55,41.55 95.55,38.25 | 95.55,38.25 94.02,38.25 92.75,36.98 90.21,36.98 88.38,35.14 U$1.P$20 88.38,33.2 88.37,33.2 86.77,32.1 v86.72,32.05 | C4.2 95.55,38.25
VCC5V
  Bottom 0.305: 83.62,11.39 83.61,11.4 R7.2 | R8.2 81.09,11.39 | R2.2 83.57,20.98 81.07,20.98 | 81.07,20.98 81.08,20.98 R1.2 81.07,20.98 | 81.07,20.98 75.99,20.98 | ENCODER1.1 ENCODER2.1 ENCODER3.1 75.99,20.98 | 75.99,11.39 ENCODER4.1 75.99,20.98
  Bottom 0.406: 5V_FPGA.1 5V_IN.1 83.62,11.39 81.09,11.39 75.99,11.39
VREF  (via drill 0.5)
  Top 0.254: CHARGER.10 19.25,55.08 v18.8,55.08 | CHARGER.4 24.39,60.3 v24.06,60.48
  Bottom 0.406: 16.73,55.62 18.25,55.63 v18.8,55.08 20.64,55.08 24.05,58.55 v24.06,60.48 | 16.73,55.62 14.98,55.62 | 14.98,55.62 R17.2 | R17.2 | 16.73,55.62 C16.2 | R15.2 23.52,45.01 R16.2 10.26,44.99 10.24,49.01 11.87,49.68 11.85,55.64 13.43,55.64 R17.2 | R26.1 12.2,59.74 14.95,56.99 14.95,55.65 14.98,55.62